# Altium project norbi_lm.PrjPcb (part 1 of 2)
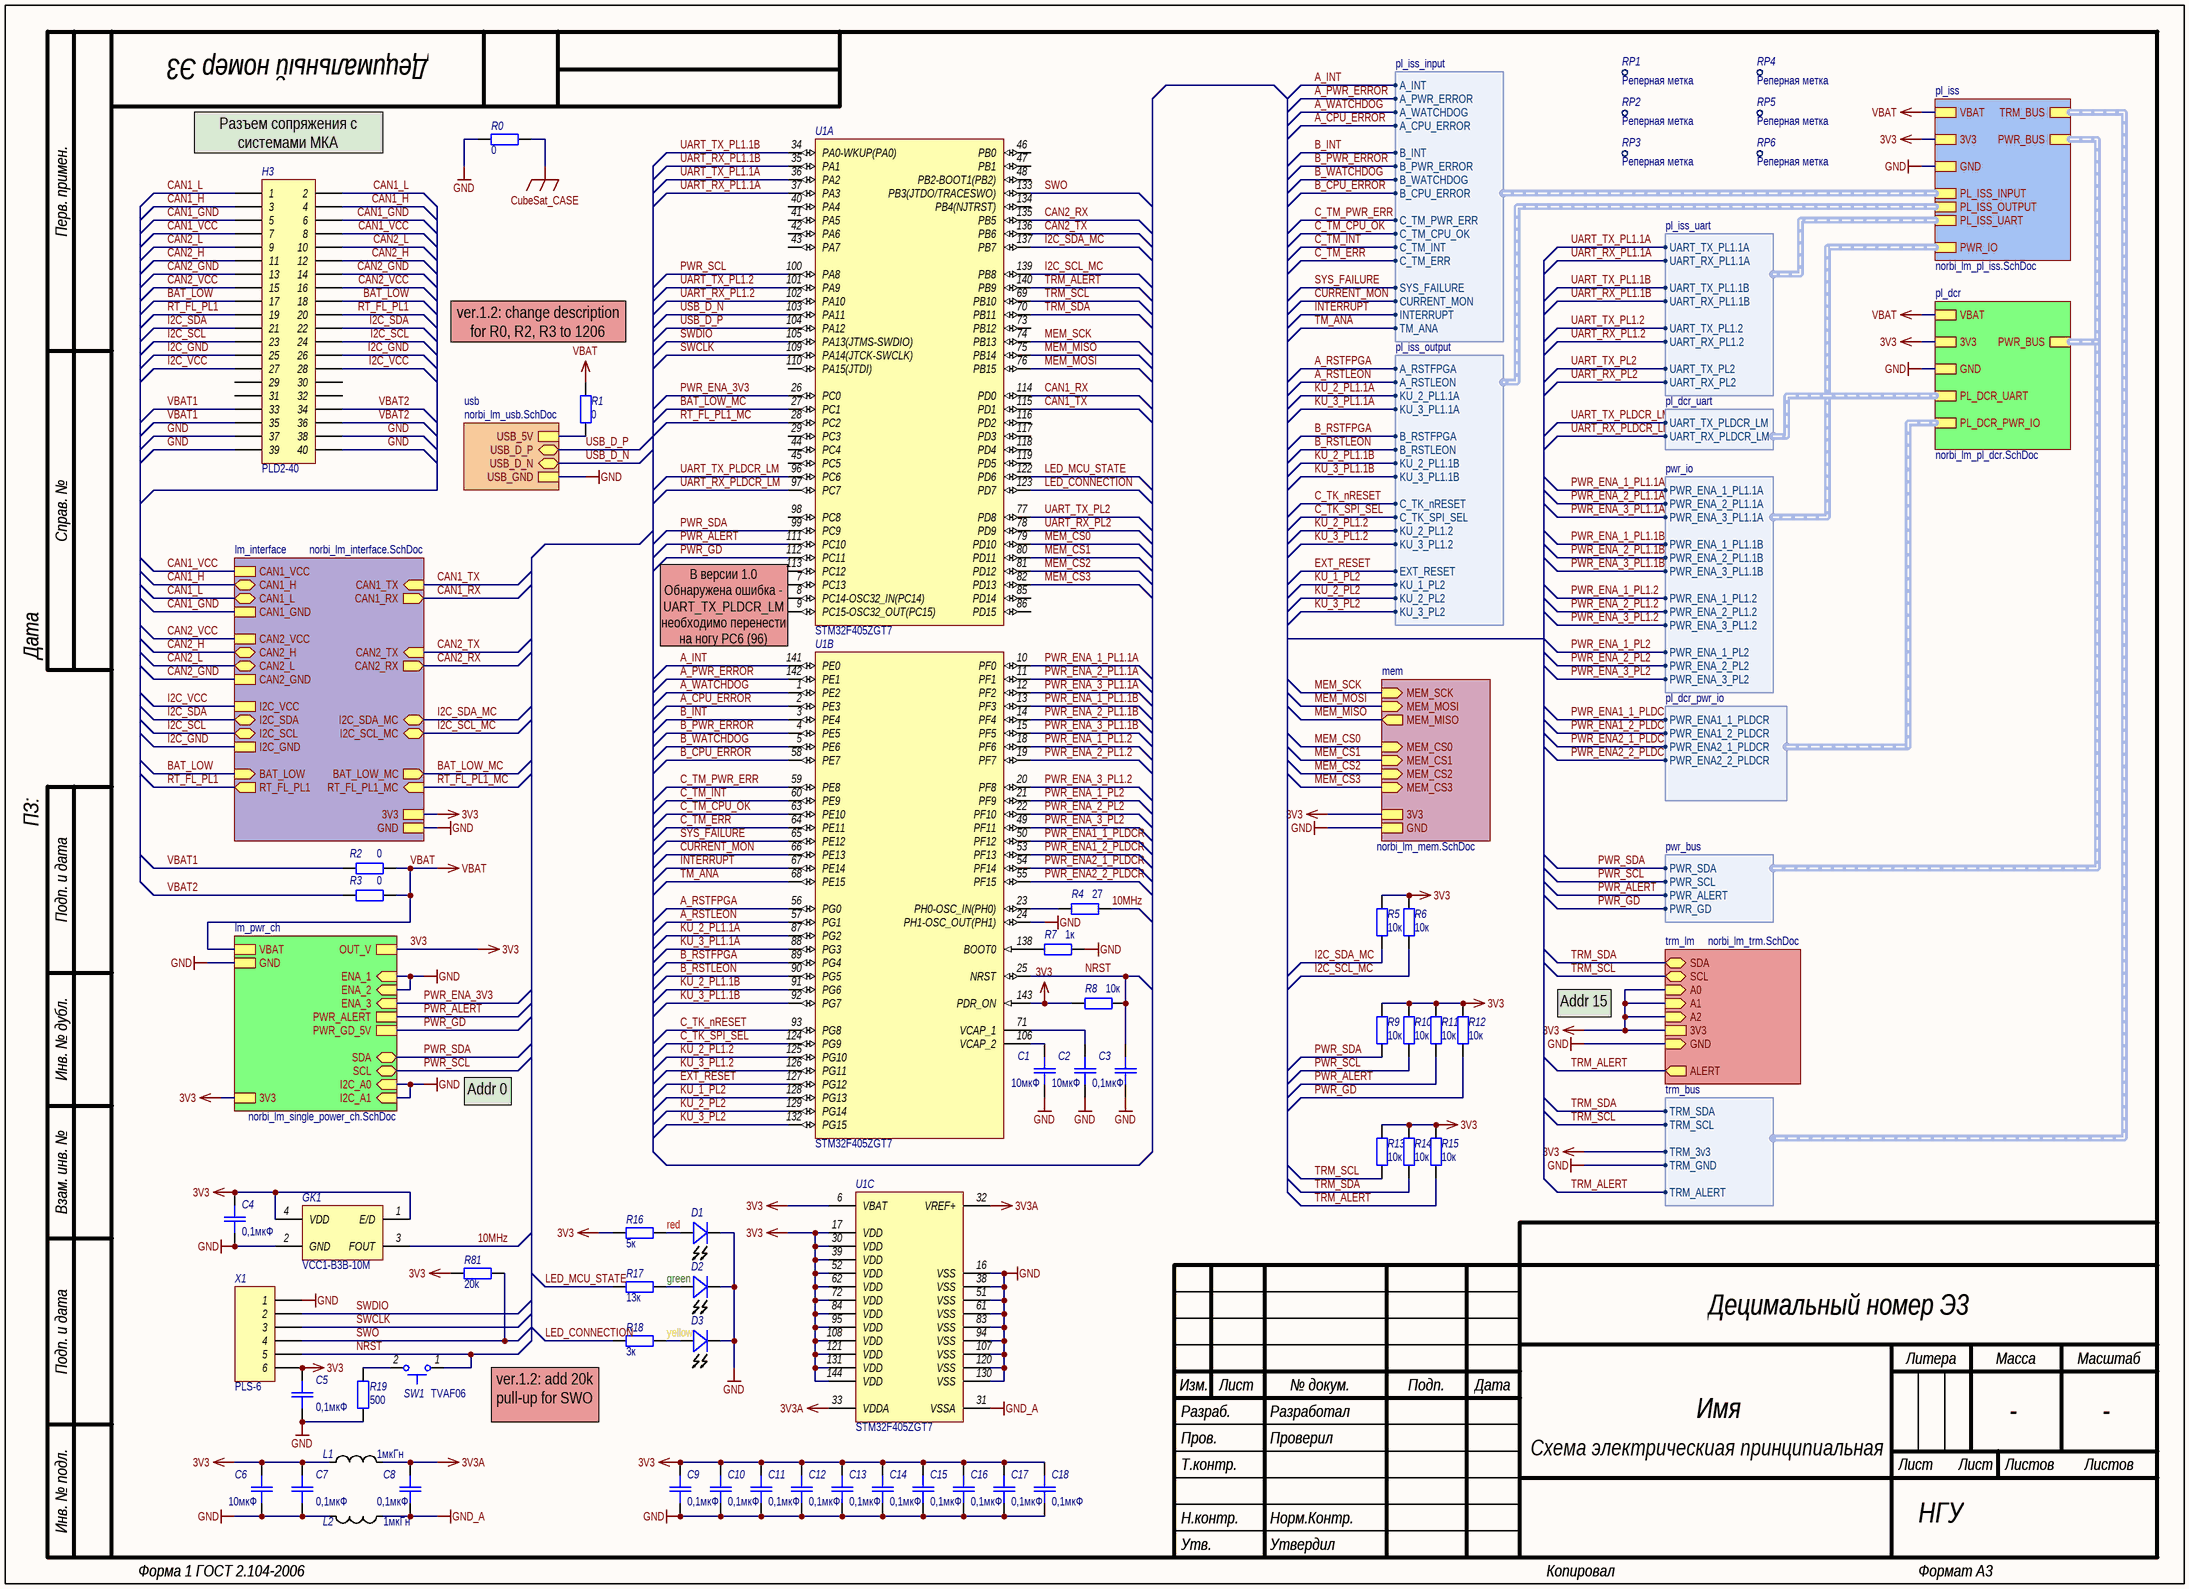
[diagram p0: norbi_lm_main.SchDoc]
10 sheets, 452 parts. Net scope: strictly hierarchical (ports join the sheet entries above them; power ports are local).
Board file: norbi_lm.PcbDoc
Sheets:
  norbi_lm_main.SchDoc
    pl_iss = norbi_lm_pl_iss.SchDoc
      pl_interface_1 = norbi_lm_pl_interface.SchDoc
      pl_interface_2 = norbi_lm_pl_interface.SchDoc
      pl_interface_3 = norbi_lm_pl_interface.SchDoc
      pl_interface_4 = norbi_lm_pl_interface.SchDoc
      pl_pwr_ch_1 = norbi_lm_single_power_ch.SchDoc
      pl_pwr_ch_2 = norbi_lm_single_power_ch.SchDoc
      pl_pwr_ch_3 = norbi_lm_single_power_ch.SchDoc
      pl_pwr_ch_4 = norbi_lm_single_power_ch.SchDoc
    pl_dcr = norbi_lm_pl_dcr.SchDoc
      mcu_pwr = norbi_lm_pl_dcr_power_ch.SchDoc
      measure_pwr = norbi_lm_pl_dcr_power_ch.SchDoc
    lm_interface = norbi_lm_interface.SchDoc
    trm_lm = norbi_lm_trm.SchDoc
    mem = norbi_lm_mem.SchDoc
    lm_pwr_ch = norbi_lm_single_power_ch.SchDoc
    usb = norbi_lm_usb.SchDoc

## Sheet norbi_lm_main.SchDoc: Имя
size 410 x 297 mm; ApprovedBy: Утвердил; CheckedBy: Проверил; Author: Разработал; Organization: НГУ; DocumentNumber: Децимальный номер Э3; SheetNumber: Лист; SheetTotal: Листов; PageSetup: Record=PageOptions|CenterHorizontal=True|CenterVertical=True|PrintScale=1.00|XCorrection=1.00|YCorrection=1.00|PrintKind=1|BorderSize=5000000|LeftOffset=0|BottomOffset=0|Orientation=2|PaperLength=1000|PaperWidth=1000|Scale=100|PaperSource=15|PrintQuality=1200|MediaType=1|DitherType=10|PaperKind=A3|PrintScaleMode=1; Weight: -; ScaleFactor: -; NormInspection: Норм.Контр.

### Parts
C1  10мкФ  [CR-0603]
C2  10мкФ  [CR-0603]
C3  0,1мкФ  [CR-0603]
C4  0,1мкФ  [CR-0603]
C5  0,1мкФ  [CR-0603]
C6  10мкФ  [CR-0603]
C7  0,1мкФ  [CR-0603]
C8  0,1мкФ  [CR-0603]
C9  0,1мкФ  [CR-0603]
C10  0,1мкФ  [CR-0603]
C11  0,1мкФ  [CR-0603]
C12  0,1мкФ  [CR-0603]
C13  0,1мкФ  [CR-0603]
C14  0,1мкФ  [CR-0603]
C15  0,1мкФ  [CR-0603]
C16  0,1мкФ  [CR-0603]
C17  0,1мкФ  [CR-0603]
C18  0,1мкФ  [CR-0603]
D1  value red  [LED-0805]  (hidden comment: LED)
D2  value green  [LED-0805]  (hidden comment: LED)
D3  value yellow  [LED-0805]  (hidden comment: LED)
GK1  Наименование: VCC1-B3B-10M  [5x7 Crystall Oscillatior]  (hidden comment: VCC1)
H3  Наименование: PLD2-40  [PLD2-40 (DS-1025-05 2x20)]  (hidden comment: Header 20X2H)
L1  1мкГн  [CR-0805]
L2  1мкГн  [CR-0805]
R0  0  [CR-0805]
R1  0  [CR-1206]
R2  0  [CR-1206]
R3  0  [CR-1206]
R4  27  [CR-0603]
R5  10к  [CR-0603]
R6  10к  [CR-0603]
R7  1к  [CR-0603]
R8  10к  [CR-0603]
R9  10к  [CR-0603]
R10  10к  [CR-0603]
R11  10к  [CR-0603]
R12  10к  [CR-0603]
R13  10к  [CR-0603]
R14  10к  [CR-0603]
R15  10к  [CR-0603]
R16  5к  [CR-0603]
R17  13к  [CR-0603]
R18  3к  [CR-0603]
R19  500  [CR-0603]
R81  20k  [CR-0603]
RP1  Наименование: Реперная метка  [ReperPoint]  (hidden comment: RP)
RP2  Наименование: Реперная метка  [ReperPoint]  (hidden comment: RP)
RP3  Наименование: Реперная метка  [ReperPoint]  (hidden comment: RP)
RP4  Наименование: Реперная метка  [ReperPoint]  (hidden comment: RP)
RP5  Наименование: Реперная метка  [ReperPoint]  (hidden comment: RP)
RP6  Наименование: Реперная метка  [ReperPoint]  (hidden comment: RP)
SW1  Push button  [TVAF06]  (value not drawn)
U1  STM32F405ZGT7  [LQFP144]  (parts A,B,C of 3)
X1  Наименование: PLS-6  [HDR1X6]  (hidden comment: Header 6)

### Sub-sheets
lm_interface = norbi_lm_interface.SchDoc: RT_FL_PL1 (out), I2C_SCL_MC (bidir), CAN1_L (bidir), CAN2_H (bidir), CAN2_VCC, RT_FL_PL1_MC (in), I2C_VCC, I2C_SDA (bidir), CAN2_GND, I2C_GND, CAN1_VCC, I2C_SCL (bidir), CAN1_H (bidir), GND, BAT_LOW (in), BAT_LOW_MC (out), CAN1_GND, CAN2_L (bidir), 3V3, I2C_SDA_MC (bidir), CAN2_TX (in), CAN2_RX (out), CAN1_TX (in), CAN1_RX (out)
lm_pwr_ch = norbi_lm_single_power_ch.SchDoc: SDA (bidir), SCL (bidir), ENA_1 (in), ENA_2 (in), ENA_3 (in), I2C_A0 (in), I2C_A1 (in), VBAT, 3V3, GND, PWR_ALERT, PWR_GD_5V, OUT_V  | R17_value: 1М; R22_value: NU; R21_value: NU; R20_value: 100; R18_value: 300к; R27_value: 10к; R1_5V_value: 150к; R2_5V_value: 47к; PULL_UP_I2C: NU
mem = norbi_lm_mem.SchDoc: 3V3, MEM_CS3 (in), GND, MEM_CS2 (in), MEM_CS1 (in), MEM_CS0 (in), MEM_SCK (in), MEM_MISO (out), MEM_MOSI (in)
pl_dcr = norbi_lm_pl_dcr.SchDoc: PL_DCR_UART (harness pl_dcr_uart), 3V3, VBAT, PL_DCR_PWR_IO (harness pl_dcr_pwr_io), PWR_BUS (harness pwr_bus), GND
pl_iss = norbi_lm_pl_iss.SchDoc: VBAT, PL_ISS_INPUT (harness pl_iss_input), GND, PL_ISS_OUTPUT (harness pl_iss_output), 3V3, PL_ISS_UART (harness pl_iss_uart), PWR_IO (harness pwr_io), TRM_BUS (harness trm_bus), PWR_BUS (harness pwr_bus)
trm_lm = norbi_lm_trm.SchDoc: A2 (in), A1 (in), A0 (in), ALERT (out), GND (in), 3V3, SCL (bidir), SDA (bidir)
usb = norbi_lm_usb.SchDoc: USB_D_N (bidir), USB_GND, USB_5V, USB_D_P (bidir)

### Harnesses
trm_bus: TRM_3v3, TRM_SDA, TRM_SCL, TRM_ALERT, TRM_GND
pwr_bus: PWR_SDA, PWR_SCL, PWR_ALERT, PWR_GD
pl_iss_uart: UART_TX_PL1.1A, UART_RX_PL1.1A, UART_TX_PL1.1B, UART_RX_PL1.1B, UART_TX_PL1.2, UART_RX_PL1.2, UART_TX_PL2, UART_RX_PL2
pwr_io: PWR_ENA_1_PL1.1A, PWR_ENA_2_PL1.1A, PWR_ENA_3_PL1.1A, PWR_ENA_1_PL1.1B, PWR_ENA_2_PL1.1B, PWR_ENA_3_PL1.1B, PWR_ENA_1_PL1.2, PWR_ENA_2_PL1.2, PWR_ENA_3_PL1.2, PWR_ENA_1_PL2, PWR_ENA_2_PL2, PWR_ENA_3_PL2
pl_iss_input: A_INT, A_PWR_ERROR, A_WATCHDOG, A_CPU_ERROR, B_INT, B_PWR_ERROR, B_WATCHDOG, B_CPU_ERROR, C_TM_PWR_ERR, C_TM_CPU_OK, C_TM_INT, C_TM_ERR, SYS_FAILURE, CURRENT_MON, INTERRUPT, TM_ANA
pl_dcr_uart: UART_TX_PLDCR_LM, UART_RX_PLDCR_LM
pl_iss_output: A_RSTFPGA, A_RSTLEON, KU_2_PL1.1A, KU_3_PL1.1A, B_RSTFPGA, B_RSTLEON, KU_2_PL1.1B, KU_3_PL1.1B, C_TK_nRESET, C_TK_SPI_SEL, KU_2_PL1.2, KU_3_PL1.2, EXT_RESET, KU_1_PL2, KU_2_PL2, KU_3_PL2
pl_dcr_pwr_io: PWR_ENA1_1_PLDCR, PWR_ENA1_2_PLDCR, PWR_ENA2_1_PLDCR, PWR_ENA2_2_PLDCR

### Nets
3V3: C4.2 C5.2 C6.2 C7.2 C9.2 C10.2 C11.2 C12.2 C13.2 C14.2 C15.2 C16.2 C17.2 C18.2 GK1.1(E/D) GK1.4(VDD) L1.1 R5.1 R6.1 R8.2 R9.1 R10.1 R11.1 R12.1 R13.1 R14.1 R15.1 R16.1 R81.1 U1.6(VBAT) U1.17(VDD) U1.30(VDD) U1.39(VDD) U1.52(VDD) U1.62(VDD) U1.72(VDD) U1.84(VDD) U1.95(VDD) U1.108(VDD) U1.121(VDD) U1.131(VDD) U1.143(PDR_ON) U1.144(VDD) X1.6 ; sheet pl_iss/3V3, sheet pl_dcr/3V3, sheet lm_interface/3V3, sheet trm_lm/A2, sheet trm_lm/A1, sheet trm_lm/A0, sheet trm_lm/3V3, sheet mem/3V3, sheet lm_pwr_ch/3V3, sheet lm_pwr_ch/OUT_V, sheet pl_iss/TRM_BUS.TRM_3v3
3V3A: C8.2 L1.2 U1.32(VREF+) U1.33(VDDA)
CAN1_GND: H3.5 H3.6 ; sheet lm_interface/CAN1_GND
CAN1_VCC: H3.7 H3.8 ; sheet lm_interface/CAN1_VCC
CAN2_GND: H3.13 H3.14 ; sheet lm_interface/CAN2_GND
CAN2_VCC: H3.15 H3.16 ; sheet lm_interface/CAN2_VCC
CubeSat_CASE: R0.1
GND: C1.1 C2.1 C3.1 C4.1 C5.1 C6.1 C7.1 C9.1 C10.1 C11.1 C12.1 C13.1 C14.1 C15.1 C16.1 C17.1 C18.1 D1.2(K) D2.2(K) D3.2(K) GK1.2(GND) H3.37 H3.38 H3.39 H3.40 L2.2 R0.2 R7.1 R19.2 U1.16(VSS) U1.24(PH1-OSC_OUT(PH1)) U1.38(VSS) U1.51(VSS) U1.61(VSS) U1.83(VSS) U1.94(VSS) U1.107(VSS) U1.120(VSS) U1.130(VSS) X1.1 ; sheet pl_iss/GND, sheet pl_dcr/GND, sheet lm_interface/GND, sheet trm_lm/GND, sheet mem/GND, sheet lm_pwr_ch/ENA_1, sheet lm_pwr_ch/ENA_2, sheet lm_pwr_ch/I2C_A0, sheet lm_pwr_ch/I2C_A1, sheet lm_pwr_ch/GND, sheet usb/USB_GND, sheet pl_iss/TRM_BUS.TRM_GND
GND_A: C8.1 L2.1 U1.31(VSSA)
I2C_GND: H3.25 H3.26 ; sheet lm_interface/I2C_GND
I2C_VCC: H3.27 H3.28 ; sheet lm_interface/I2C_VCC
VBAT: R1.2 R2.2 R3.2 ; sheet pl_iss/VBAT, sheet pl_dcr/VBAT, sheet lm_pwr_ch/VBAT
10MHz: GK1.3(FOUT) R4.2
A_CPU_ERROR: U1.2(PE3) ; sheet pl_iss/PL_ISS_INPUT.A_CPU_ERROR
A_INT: U1.141(PE0) ; sheet pl_iss/PL_ISS_INPUT.A_INT
A_PWR_ERROR: U1.142(PE1) ; sheet pl_iss/PL_ISS_INPUT.A_PWR_ERROR
A_RSTFPGA: U1.56(PG0) ; sheet pl_iss/PL_ISS_OUTPUT.A_RSTFPGA
A_RSTLEON: U1.57(PG1) ; sheet pl_iss/PL_ISS_OUTPUT.A_RSTLEON
A_WATCHDOG: U1.1(PE2) ; sheet pl_iss/PL_ISS_INPUT.A_WATCHDOG
B_CPU_ERROR: U1.58(PE7) ; sheet pl_iss/PL_ISS_INPUT.B_CPU_ERROR
B_INT: U1.3(PE4) ; sheet pl_iss/PL_ISS_INPUT.B_INT
B_PWR_ERROR: U1.4(PE5) ; sheet pl_iss/PL_ISS_INPUT.B_PWR_ERROR
B_RSTFPGA: U1.89(PG4) ; sheet pl_iss/PL_ISS_OUTPUT.B_RSTFPGA
B_RSTLEON: U1.90(PG5) ; sheet pl_iss/PL_ISS_OUTPUT.B_RSTLEON
B_WATCHDOG: U1.5(PE6) ; sheet pl_iss/PL_ISS_INPUT.B_WATCHDOG
BAT_LOW: H3.17 H3.18 ; sheet lm_interface/BAT_LOW
BAT_LOW_MC: U1.27(PC1) ; sheet lm_interface/BAT_LOW_MC
C_TK_nRESET: U1.93(PG8) ; sheet pl_iss/PL_ISS_OUTPUT.C_TK_nRESET
C_TK_SPI_SEL: U1.124(PG9) ; sheet pl_iss/PL_ISS_OUTPUT.C_TK_SPI_SEL
C_TM_CPU_OK: U1.63(PE10) ; sheet pl_iss/PL_ISS_INPUT.C_TM_CPU_OK
C_TM_ERR: U1.64(PE11) ; sheet pl_iss/PL_ISS_INPUT.C_TM_ERR
C_TM_INT: U1.60(PE9) ; sheet pl_iss/PL_ISS_INPUT.C_TM_INT
C_TM_PWR_ERR: U1.59(PE8) ; sheet pl_iss/PL_ISS_INPUT.C_TM_PWR_ERR
CAN1_H: H3.3 H3.4 ; sheet lm_interface/CAN1_H
CAN1_L: H3.1 H3.2 ; sheet lm_interface/CAN1_L
CAN1_RX: U1.114(PD0) ; sheet lm_interface/CAN1_RX
CAN1_TX: U1.115(PD1) ; sheet lm_interface/CAN1_TX
CAN2_H: H3.11 H3.12 ; sheet lm_interface/CAN2_H
CAN2_L: H3.9 H3.10 ; sheet lm_interface/CAN2_L
CAN2_RX: U1.135(PB5) ; sheet lm_interface/CAN2_RX
CAN2_TX: U1.136(PB6) ; sheet lm_interface/CAN2_TX
CURRENT_MON: U1.66(PE13) ; sheet pl_iss/PL_ISS_INPUT.CURRENT_MON
EXT_RESET: U1.127(PG12) ; sheet pl_iss/PL_ISS_OUTPUT.EXT_RESET
I2C_SCL: H3.23 H3.24 ; sheet lm_interface/I2C_SCL
I2C_SCL_MC: R6.2 U1.139(PB8) ; sheet lm_interface/I2C_SCL_MC
I2C_SDA: H3.21 H3.22 ; sheet lm_interface/I2C_SDA
I2C_SDA_MC: R5.2 U1.137(PB7) ; sheet lm_interface/I2C_SDA_MC
INTERRUPT: U1.67(PE14) ; sheet pl_iss/PL_ISS_INPUT.INTERRUPT
KU_1_PL2: U1.128(PG13) ; sheet pl_iss/PL_ISS_OUTPUT.KU_1_PL2
KU_2_PL1.1A: U1.87(PG2) ; sheet pl_iss/PL_ISS_OUTPUT.KU_2_PL1.1A
KU_2_PL1.1B: U1.91(PG6) ; sheet pl_iss/PL_ISS_OUTPUT.KU_2_PL1.1B
KU_2_PL1.2: U1.125(PG10) ; sheet pl_iss/PL_ISS_OUTPUT.KU_2_PL1.2
KU_2_PL2: U1.129(PG14) ; sheet pl_iss/PL_ISS_OUTPUT.KU_2_PL2
KU_3_PL1.1A: U1.88(PG3) ; sheet pl_iss/PL_ISS_OUTPUT.KU_3_PL1.1A
KU_3_PL1.1B: U1.92(PG7) ; sheet pl_iss/PL_ISS_OUTPUT.KU_3_PL1.1B
KU_3_PL1.2: U1.126(PG11) ; sheet pl_iss/PL_ISS_OUTPUT.KU_3_PL1.2
KU_3_PL2: U1.132(PG15) ; sheet pl_iss/PL_ISS_OUTPUT.KU_3_PL2
LED_CONNECTION: R18.1 U1.123(PD7)
LED_MCU_STATE: R17.1 U1.122(PD6)
MEM_CS0: U1.79(PD10) ; sheet mem/MEM_CS0
MEM_CS1: U1.80(PD11) ; sheet mem/MEM_CS1
MEM_CS2: U1.81(PD12) ; sheet mem/MEM_CS2
MEM_CS3: U1.82(PD13) ; sheet mem/MEM_CS3
MEM_MISO: U1.75(PB14) ; sheet mem/MEM_MISO
MEM_MOSI: U1.76(PB15) ; sheet mem/MEM_MOSI
MEM_SCK: U1.74(PB13) ; sheet mem/MEM_SCK
NRST: C3.2 R8.1 SW1.1 U1.25(NRST) X1.5
PWR_ALERT: R11.2 U1.111(PC10) ; sheet lm_pwr_ch/PWR_ALERT, sheet pl_iss/PWR_BUS.PWR_ALERT
PWR_ENA1_1_PLDCR: U1.50(PF12) ; sheet pl_dcr/PL_DCR_PWR_IO.PWR_ENA1_1_PLDCR
PWR_ENA1_2_PLDCR: U1.53(PF13) ; sheet pl_dcr/PL_DCR_PWR_IO.PWR_ENA1_2_PLDCR
PWR_ENA2_1_PLDCR: U1.54(PF14) ; sheet pl_dcr/PL_DCR_PWR_IO.PWR_ENA2_1_PLDCR
PWR_ENA2_2_PLDCR: U1.55(PF15) ; sheet pl_dcr/PL_DCR_PWR_IO.PWR_ENA2_2_PLDCR
PWR_ENA_1_PL1.1A: U1.10(PF0) ; sheet pl_iss/PWR_IO.PWR_ENA_1_PL1.1A
PWR_ENA_1_PL1.1B: U1.13(PF3) ; sheet pl_iss/PWR_IO.PWR_ENA_1_PL1.1B
PWR_ENA_1_PL1.2: U1.18(PF6) ; sheet pl_iss/PWR_IO.PWR_ENA_1_PL1.2
PWR_ENA_1_PL2: U1.21(PF9) ; sheet pl_iss/PWR_IO.PWR_ENA_1_PL2
PWR_ENA_2_PL1.1A: U1.11(PF1) ; sheet pl_iss/PWR_IO.PWR_ENA_2_PL1.1A
PWR_ENA_2_PL1.1B: U1.14(PF4) ; sheet pl_iss/PWR_IO.PWR_ENA_2_PL1.1B
PWR_ENA_2_PL1.2: U1.19(PF7) ; sheet pl_iss/PWR_IO.PWR_ENA_2_PL1.2
PWR_ENA_2_PL2: U1.22(PF10) ; sheet pl_iss/PWR_IO.PWR_ENA_2_PL2
PWR_ENA_3_PL1.1A: U1.12(PF2) ; sheet pl_iss/PWR_IO.PWR_ENA_3_PL1.1A
PWR_ENA_3_PL1.1B: U1.15(PF5) ; sheet pl_iss/PWR_IO.PWR_ENA_3_PL1.1B
PWR_ENA_3_PL1.2: U1.20(PF8) ; sheet pl_iss/PWR_IO.PWR_ENA_3_PL1.2
PWR_ENA_3_PL2: U1.49(PF11) ; sheet pl_iss/PWR_IO.PWR_ENA_3_PL2
PWR_ENA_3V3: U1.26(PC0) ; sheet lm_pwr_ch/ENA_3
PWR_GD: R12.2 U1.112(PC11) ; sheet lm_pwr_ch/PWR_GD_5V, sheet pl_iss/PWR_BUS.PWR_GD
PWR_SCL: R10.2 U1.100(PA8) ; sheet lm_pwr_ch/SCL, sheet pl_iss/PWR_BUS.PWR_SCL
PWR_SDA: R9.2 U1.99(PC9) ; sheet lm_pwr_ch/SDA, sheet pl_iss/PWR_BUS.PWR_SDA
RT_FL_PL1: H3.19 H3.20 ; sheet lm_interface/RT_FL_PL1
RT_FL_PL1_MC: U1.28(PC2) ; sheet lm_interface/RT_FL_PL1_MC
SWCLK: U1.109(PA14(JTCK-SWCLK)) X1.3
SWDIO: U1.105(PA13(JTMS-SWDIO)) X1.2
SWO: R81.2 U1.133(PB3(JTDO/TRACESWO)) X1.4
SYS_FAILURE: U1.65(PE12) ; sheet pl_iss/PL_ISS_INPUT.SYS_FAILURE
TM_ANA: U1.68(PE15) ; sheet pl_iss/PL_ISS_INPUT.TM_ANA
TRM_ALERT: R15.2 U1.140(PB9) ; sheet trm_lm/ALERT, sheet pl_iss/TRM_BUS.TRM_ALERT
TRM_SCL: R13.2 U1.69(PB10) ; sheet trm_lm/SCL, sheet pl_iss/TRM_BUS.TRM_SCL
TRM_SDA: R14.2 U1.70(PB11) ; sheet trm_lm/SDA, sheet pl_iss/TRM_BUS.TRM_SDA
UART_RX_PL1.1A: U1.37(PA3) ; sheet pl_iss/PL_ISS_UART.UART_RX_PL1.1A
UART_RX_PL1.1B: U1.35(PA1) ; sheet pl_iss/PL_ISS_UART.UART_RX_PL1.1B
UART_RX_PL1.2: U1.102(PA10) ; sheet pl_iss/PL_ISS_UART.UART_RX_PL1.2
UART_RX_PL2: U1.78(PD9) ; sheet pl_iss/PL_ISS_UART.UART_RX_PL2
UART_RX_PLDCR_LM: U1.97(PC7) ; sheet pl_dcr/PL_DCR_UART.UART_RX_PLDCR_LM
UART_TX_PL1.1A: U1.36(PA2) ; sheet pl_iss/PL_ISS_UART.UART_TX_PL1.1A
UART_TX_PL1.1B: U1.34(PA0-WKUP(PA0)) ; sheet pl_iss/PL_ISS_UART.UART_TX_PL1.1B
UART_TX_PL1.2: U1.101(PA9) ; sheet pl_iss/PL_ISS_UART.UART_TX_PL1.2
UART_TX_PL2: U1.77(PD8) ; sheet pl_iss/PL_ISS_UART.UART_TX_PL2
UART_TX_PLDCR_LM: U1.96(PC6) ; sheet pl_dcr/PL_DCR_UART.UART_TX_PLDCR_LM
USB_D_N: U1.103(PA11) ; sheet usb/USB_D_N
USB_D_P: U1.104(PA12) ; sheet usb/USB_D_P
VBAT1: H3.33 H3.35 R2.1
VBAT2: H3.34 H3.36 R3.1
NetC1_2: C1.2 U1.106(VCAP_2)
NetC2_2: C2.2 U1.71(VCAP_1)
NetD1_1: D1.1(A) R16.2
NetD2_1: D2.1(A) R17.2
NetD3_1: D3.1(A) R18.2
NetR1_1: R1.1 ; sheet usb/USB_5V
NetR4_1: R4.1 U1.23(PH0-OSC_IN(PH0))
NetR7_2: R7.2 U1.138(BOOT0)
NetR19_1: R19.1 SW1.2

Not connected (* = marked no-connect by the designer): H3 29 30 31 32; U1 7(PC13) 8(PC14-OSC32_IN(PC14)) 9(PC15-OSC32_OUT(PC15)) 29(PC3) 40(PA4) 41(PA5) 42(PA6) 43(PA7) 44(PC4) 45(PC5) 46(PB0) 47(PB1) 48(PB2-BOOT1(PB2)) 73(PB12) 85(PD14) 86(PD15) 98(PC8) 110(PA15(JTDI)) 113(PC12) 116(PD2) 117(PD3) 118(PD4) 119(PD5) 134(PB4(NJTRST))

### Buses and harness runs
harness sheet pl_dcr/PWR_BUS = sheet pl_iss/PWR_BUS

### Notes on the sheet
- (near H3) Разъем сопряжения с системами МКА
- ver.1.2: change description for R0, R2, R3 to 1206
- (near U1) В версии 1.0 Обнаружена ошибка - UART_TX_PLDCR_LM необходимо перенести на ногу PC6 (96)
- Addr 15
- Addr 0
- ver.1.2: add 20k pull-up for SWO
- Перв. примен.
- Справ. №
- ПЗ:                             Дата
- Подп. и дата
- Инв. № дубл.
- Взам. инв. №
- Разраб.
- Изм.
- Лист
- № докум.
- Подп.
- Дата
- Литера
- Масса
- Масштаб
- Пров.
- Т.контр.
- Схема электрическиая принципиальная
- Листов
- Инв. № подл.
- Н.контр.
- Утв.
- Форма 1 ГОСТ 2.104-2006
- Копировал
- Формат А3

### Library data of the parts
C1-C18 = C_smd: Конденсатор для поверхностного монтажа; Назначение: Чип-конденсатор; Потребление, Вт: 0; Наименование: SMD-0603
  C1 C2 C6: Value: 10мкФ
  C3-C5 C7-C18: Value: 0,1мкФ
D1-D3 = LED: Назначение: Светодиод; Наименование: LED SMD-0805; Потребление, Вт: 0,01
GK1 = Crystall Oscillator: Назначение: Кварцевый генератор 7x5мм 20 МГц; Потребление, Вт: 0,01
H3 = HDR2X20: Header, 20-Pin, Dual row, Right Angle; Потребление, Вт: 0,0; Назначение: Header, 20-Pin, Dual row, Right Angle
L1 L2 = L_smd: Индуктивность для поверхностнгого монтажа; Назначение: Чип-индуктивность; Потребление, Вт: 0,010; Value: 1мкГн; Наименование: Индуктивность
R0 R4-R19 R81 = R_smd: Резистор для поверхностного монтажа; Наименование: SMD-0603,  20%; Назначение: Чип-резистор; Потребление, Вт: 0,001
  R0: Value: 0
  R4: Value: 27
  R5 R6 R8-R15: Value: 10к
  R7: Value: 1к
  R16: Value: 5к
  R17: Value: 13к
  R18: Value: 3к
  R19: Value: 500
  R81: Value: 20k
R1-R3 = R_smd: Резистор для поверхностного монтажа; Наименование: SMD-1206,  20%; Назначение: Чип-резистор; Потребление, Вт: 0,001; Value: 0
RP1-RP6 = RP: Назначение: реперная метка для автоматического монтажа
SW1 = Push_Button: Потребление, Вт: 0,001; Назначение: Push button; Наименование: TVAF06
U1 = STM32F405ZGT: ARM Cortex-M4 32-bit MCU+FPU, 210 DMIPS, 1024 kB Flash, 192 kB Internal RAM, 114 I/Os, 144-pin LQFP, -40 to 105 degC, Tray; Наименование: STM32F405ZGT7; Назначение: ARM Cortex-M4 32-bit MCU+FPU; Потребление, Вт: *; ComponentLink1Description: Datasheet; ComponentLink1URL: http://www.st.com/st-web-ui/static/active/en/resource/technical/document/datasheet/DM00037051.pdf
X1 = Header 6: Header, 6-Pin; Назначение: Отладочный разъем; LatestRevisionDate: 17-Jul-2002; LatestRevisionNote: Re-released for DXP Platform.; Publisher: Altium Limited

## Sheet norbi_lm_pl_iss.SchDoc: Имя
size 410 x 297 mm; ApprovedBy: Утвердил; CheckedBy: Проверил; Author: Разработал; Organization: НГУ; DocumentNumber: Децимальный номер Э3; SheetNumber: Лист; SheetTotal: Листов; PageSetup: Record=PageOptions|CenterHorizontal=True|CenterVertical=True|PrintScale=1.00|XCorrection=1.00|YCorrection=1.00|PrintKind=1|BorderSize=5000000|LeftOffset=0|BottomOffset=0|Orientation=2|PaperLength=1000|PaperWidth=1000|Scale=100|PaperSource=15|PrintQuality=1200|MediaType=1|DitherType=10|PaperKind=A3|PrintScaleMode=1; Weight: -; ScaleFactor: -; NormInspection: Норм.Контр.
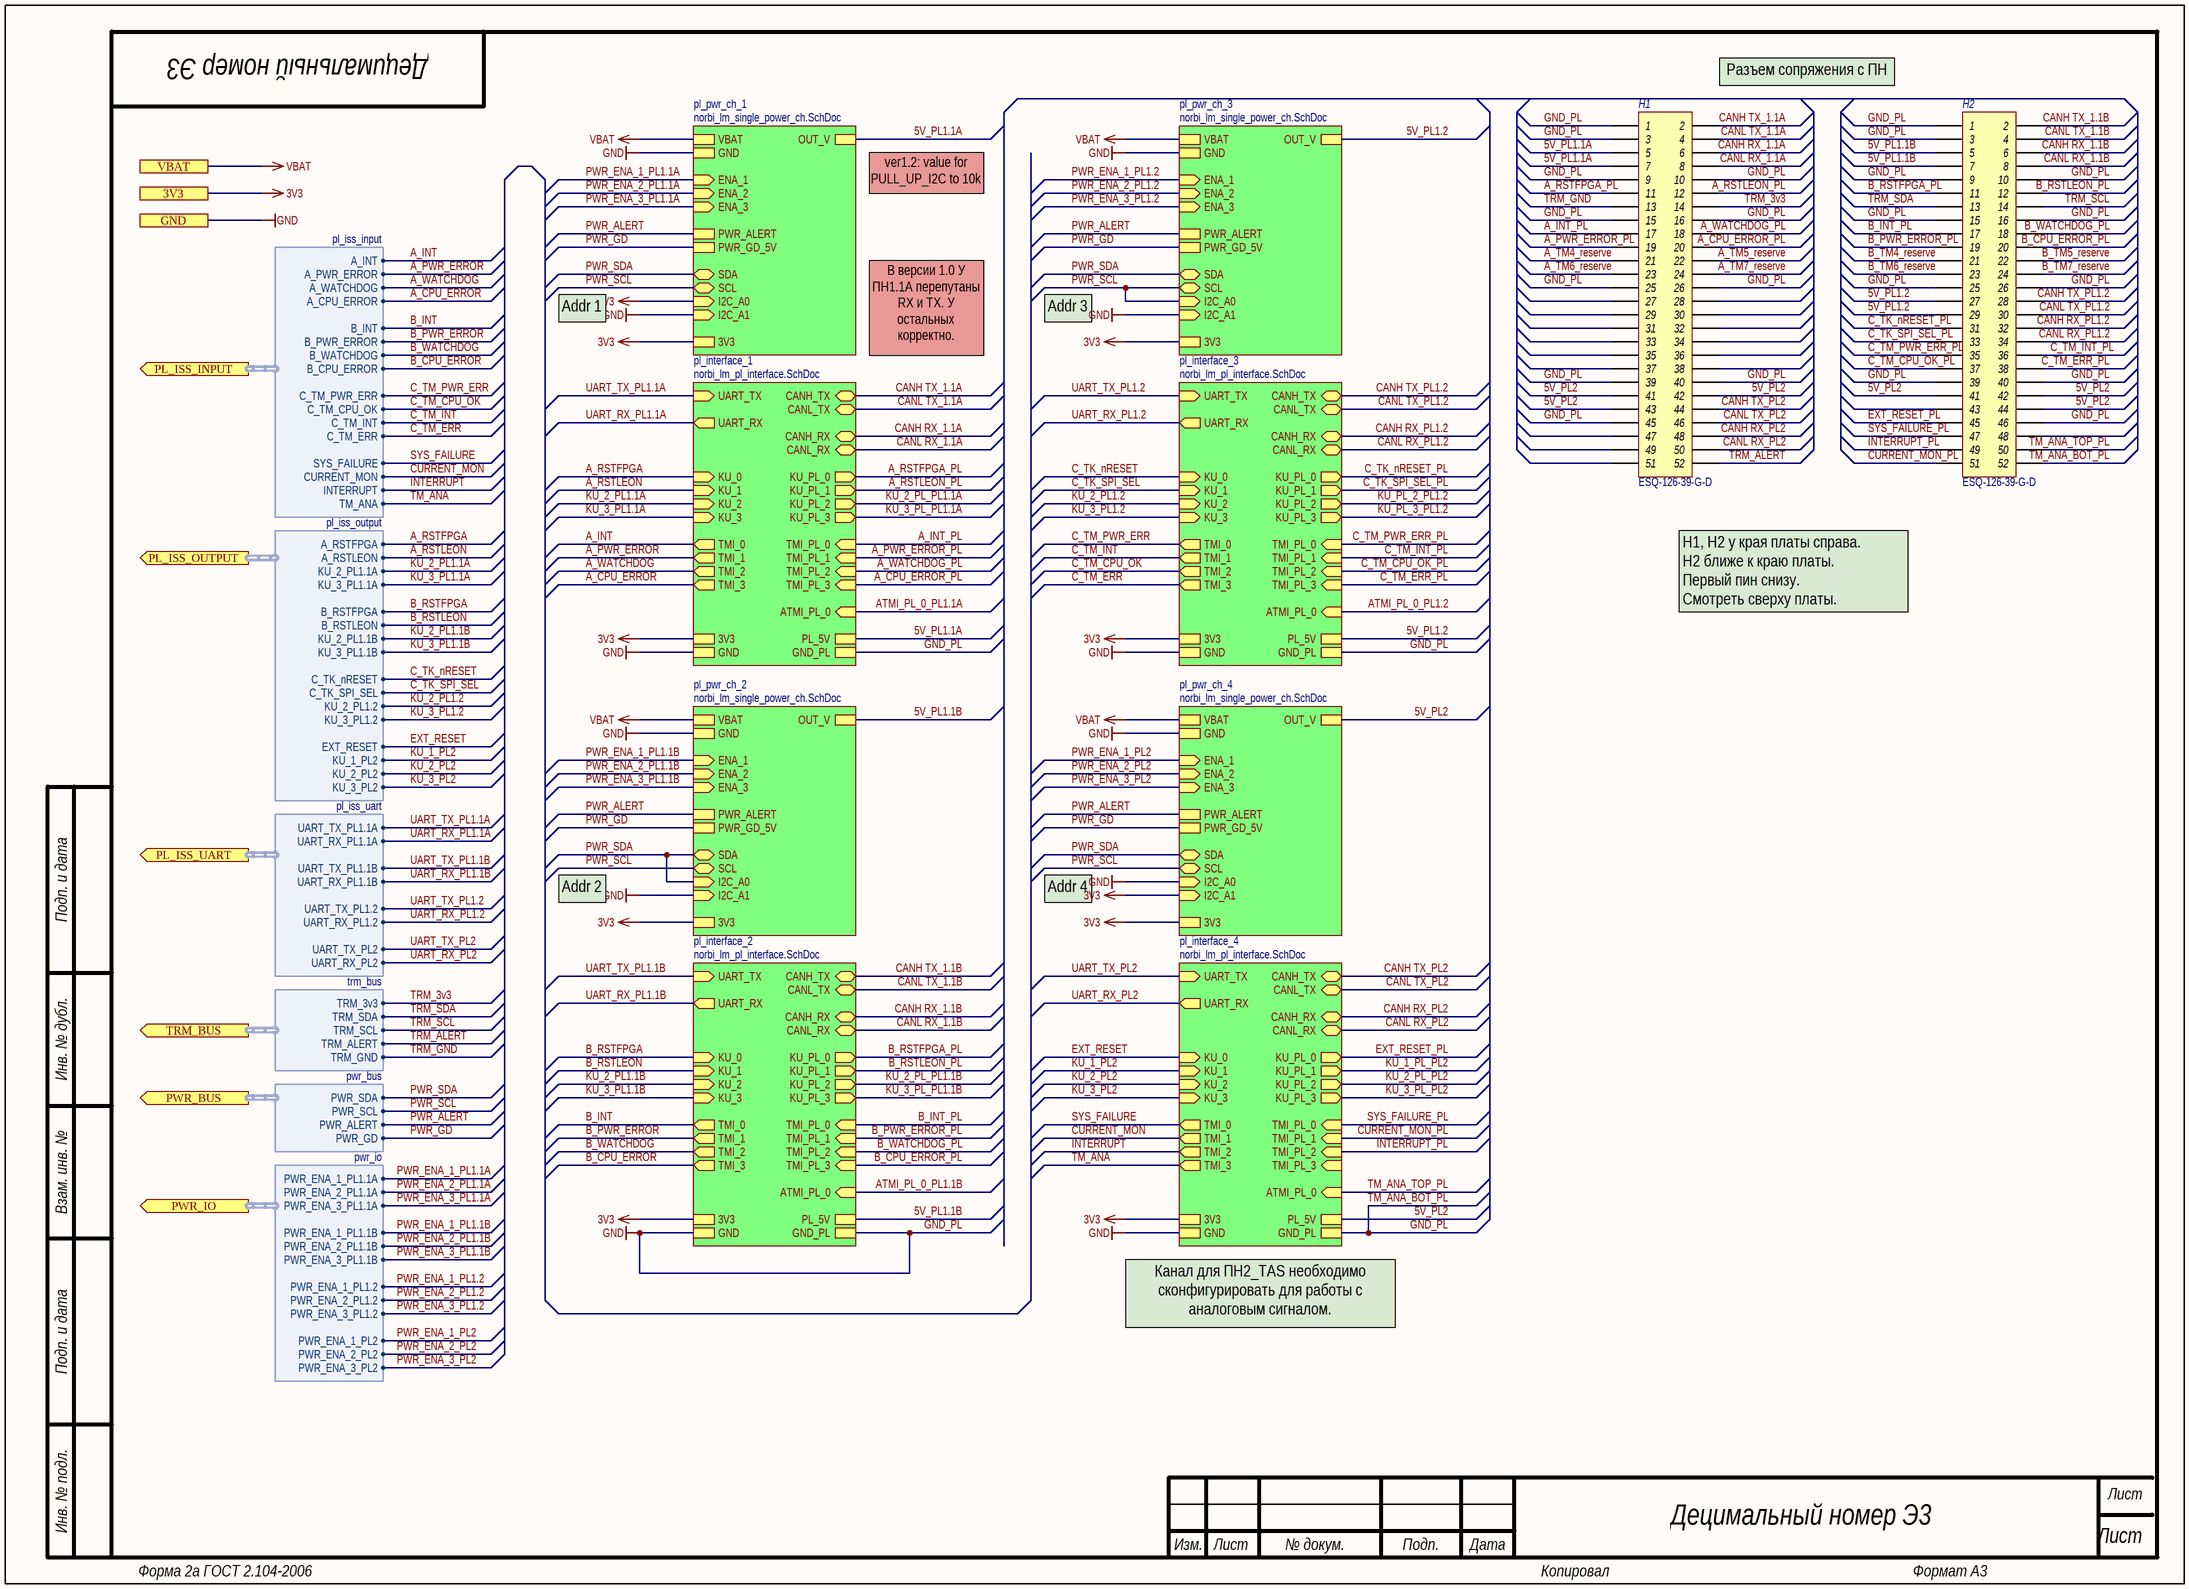
[diagram p1: norbi_lm_pl_iss.SchDoc]

### Parts
H1  ESQ-126-39-G-D  [ESQ-126-39-G-D]
H2  ESQ-126-39-G-D  [ESQ-126-39-G-D]

### Sub-sheets
pl_interface_1 = norbi_lm_pl_interface.SchDoc: KU_2 (in), CANL_TX (bidir), TMI_1 (out), KU_0 (in), TMI_0 (out), TMI_2 (out), TMI_3 (out), CANL_RX (bidir), CANH_TX (bidir), KU_3 (in), CANH_RX (bidir), KU_1 (in), TMI_PL_3 (in), KU_PL_1 (out), TMI_PL_2 (in), TMI_PL_1 (in), KU_PL_0 (out), TMI_PL_0 (in), KU_PL_3 (out), KU_PL_2 (out), ATMI_PL_0 (in), PL_5V, UART_RX (out), GND, GND_PL, UART_TX (in), 3V3
pl_interface_2 = norbi_lm_pl_interface.SchDoc: KU_2 (in), CANL_TX (bidir), TMI_1 (out), KU_0 (in), TMI_0 (out), TMI_2 (out), TMI_3 (out), CANL_RX (bidir), CANH_TX (bidir), KU_3 (in), CANH_RX (bidir), KU_1 (in), TMI_PL_3 (in), KU_PL_1 (out), TMI_PL_2 (in), TMI_PL_1 (in), KU_PL_0 (out), TMI_PL_0 (in), KU_PL_3 (out), KU_PL_2 (out), ATMI_PL_0 (in), PL_5V, UART_RX (out), GND, GND_PL, UART_TX (in), 3V3
pl_interface_3 = norbi_lm_pl_interface.SchDoc: KU_2 (in), CANL_TX (bidir), TMI_1 (out), KU_0 (in), TMI_0 (out), TMI_2 (out), TMI_3 (out), CANL_RX (bidir), CANH_TX (bidir), KU_3 (in), CANH_RX (bidir), KU_1 (in), TMI_PL_3 (in), KU_PL_1 (out), TMI_PL_2 (in), TMI_PL_1 (in), KU_PL_0 (out), TMI_PL_0 (in), KU_PL_3 (out), KU_PL_2 (out), ATMI_PL_0 (in), PL_5V, UART_RX (out), GND, GND_PL, UART_TX (in), 3V3
pl_interface_4 = norbi_lm_pl_interface.SchDoc: KU_2 (in), CANL_TX (bidir), TMI_1 (out), KU_0 (in), TMI_0 (out), TMI_2 (out), TMI_3 (out), CANL_RX (bidir), CANH_TX (bidir), KU_3 (in), CANH_RX (bidir), KU_1 (in), TMI_PL_3 (in), KU_PL_1 (out), TMI_PL_2 (in), TMI_PL_1 (in), KU_PL_0 (out), TMI_PL_0 (in), KU_PL_3 (out), KU_PL_2 (out), ATMI_PL_0 (in), PL_5V, UART_RX (out), GND, GND_PL, UART_TX (in), 3V3
pl_pwr_ch_1 = norbi_lm_single_power_ch.SchDoc: SDA (bidir), SCL (bidir), ENA_1 (in), ENA_2 (in), ENA_3 (in), I2C_A0 (in), I2C_A1 (in), VBAT, 3V3, GND, PWR_ALERT, PWR_GD_5V, OUT_V  | R17_value: 1М; R22_value: 100; R21_value: 100; R20_value: 100; R18_value: 300к; R27_value: NU; R1_5V_value: 160к; R2_5V_value: 30к; PULL_UP_I2C: 10к
pl_pwr_ch_2 = norbi_lm_single_power_ch.SchDoc: SDA (bidir), SCL (bidir), ENA_1 (in), ENA_2 (in), ENA_3 (in), I2C_A0 (in), I2C_A1 (in), VBAT, 3V3, GND, PWR_ALERT, PWR_GD_5V, OUT_V  | R17_value: 1М; R22_value: 100; R21_value: 100; R20_value: 100; R18_value: 300к; R27_value: NU; R1_5V_value: 160к; R2_5V_value: 30к; PULL_UP_I2C: NU
pl_pwr_ch_3 = norbi_lm_single_power_ch.SchDoc: SDA (bidir), SCL (bidir), ENA_1 (in), ENA_2 (in), ENA_3 (in), I2C_A0 (in), I2C_A1 (in), VBAT, 3V3, GND, PWR_ALERT, PWR_GD_5V, OUT_V  | R17_value: 1М; R22_value: 100; R21_value: 100; R20_value: 100; R18_value: 300к; R27_value: NU; R1_5V_value: 160к; R2_5V_value: 30к; PULL_UP_I2C: NU
pl_pwr_ch_4 = norbi_lm_single_power_ch.SchDoc: SDA (bidir), SCL (bidir), ENA_1 (in), ENA_2 (in), ENA_3 (in), I2C_A0 (in), I2C_A1 (in), VBAT, 3V3, GND, PWR_ALERT, PWR_GD_5V, OUT_V  | R17_value: 1М; R22_value: 100; R21_value: 100; R20_value: 100; R18_value: 300к; R27_value: NU; R1_5V_value: 160к; R2_5V_value: 30к; PULL_UP_I2C: NU

### Ports
3V3, GND, PL_ISS_INPUT (out, harness pl_iss_input), PL_ISS_OUTPUT (out, harness pl_iss_output), PL_ISS_UART (out, harness pl_iss_uart), PWR_BUS (out, harness pwr_bus), PWR_IO (out, harness pwr_io), TRM_BUS (out, harness trm_bus), VBAT

### Harnesses
pl_iss_input: A_INT, A_PWR_ERROR, A_WATCHDOG, A_CPU_ERROR, B_INT, B_PWR_ERROR, B_WATCHDOG, B_CPU_ERROR, C_TM_PWR_ERR, C_TM_CPU_OK, C_TM_INT, C_TM_ERR, SYS_FAILURE, CURRENT_MON, INTERRUPT, TM_ANA
pl_iss_output: A_RSTFPGA, A_RSTLEON, KU_2_PL1.1A, KU_3_PL1.1A, B_RSTFPGA, B_RSTLEON, KU_2_PL1.1B, KU_3_PL1.1B, C_TK_nRESET, C_TK_SPI_SEL, KU_2_PL1.2, KU_3_PL1.2, EXT_RESET, KU_1_PL2, KU_2_PL2, KU_3_PL2
pl_iss_uart: UART_TX_PL1.1A, UART_RX_PL1.1A, UART_TX_PL1.1B, UART_RX_PL1.1B, UART_TX_PL1.2, UART_RX_PL1.2, UART_TX_PL2, UART_RX_PL2
trm_bus: TRM_3v3, TRM_SDA, TRM_SCL, TRM_ALERT, TRM_GND
pwr_bus: PWR_SDA, PWR_SCL, PWR_ALERT, PWR_GD
pwr_io: PWR_ENA_1_PL1.1A, PWR_ENA_2_PL1.1A, PWR_ENA_3_PL1.1A, PWR_ENA_1_PL1.1B, PWR_ENA_2_PL1.1B, PWR_ENA_3_PL1.1B, PWR_ENA_1_PL1.2, PWR_ENA_2_PL1.2, PWR_ENA_3_PL1.2, PWR_ENA_1_PL2, PWR_ENA_2_PL2, PWR_ENA_3_PL2

### Nets
3V3: H1.14 ; port 3V3, sheet pl_interface_1/3V3, sheet pl_interface_2/3V3, sheet pl_interface_3/3V3, sheet pl_interface_4/3V3, sheet pl_pwr_ch_1/I2C_A0, sheet pl_pwr_ch_1/3V3, sheet pl_pwr_ch_2/3V3, sheet pl_pwr_ch_3/3V3, sheet pl_pwr_ch_4/I2C_A1, sheet pl_pwr_ch_4/3V3, port TRM_BUS.TRM_3v3  [also labelled TRM_3v3]
5V_PL1.1B: H2.5 H2.7 ; sheet pl_interface_2/PL_5V, sheet pl_pwr_ch_2/OUT_V
5V_PL1.1А: H1.5 H1.7 ; sheet pl_interface_1/PL_5V, sheet pl_pwr_ch_1/OUT_V
5V_PL1.2: H2.27 H2.29 ; sheet pl_interface_3/PL_5V, sheet pl_pwr_ch_3/OUT_V
5V_PL2: H1.41 H1.42 H1.43 H2.41 H2.42 H2.44 ; sheet pl_interface_4/PL_5V, sheet pl_pwr_ch_4/OUT_V
GND: H1.1 H1.3 H1.9 H1.10 H1.13 H1.15 H1.16 H1.25 H1.26 H1.39 H1.40 H1.45 H2.1 H2.3 H2.9 H2.10 H2.15 H2.16 H2.25 H2.26 H2.39 H2.40 H2.46 H2.52 ; port GND, sheet pl_interface_1/GND, sheet pl_interface_1/GND_PL, sheet pl_interface_2/GND, sheet pl_interface_2/GND_PL, sheet pl_interface_3/GND, sheet pl_interface_3/GND_PL, sheet pl_interface_4/GND, sheet pl_interface_4/GND_PL, sheet pl_pwr_ch_1/I2C_A1, sheet pl_pwr_ch_1/GND, sheet pl_pwr_ch_2/I2C_A1, sheet pl_pwr_ch_2/GND, sheet pl_pwr_ch_3/I2C_A1, sheet pl_pwr_ch_3/GND, sheet pl_pwr_ch_4/I2C_A0, sheet pl_pwr_ch_4/GND, port TRM_BUS.TRM_GND  [also labelled GND_PL, TM_ANA_BOT_PL, TRM_GND]
VBAT: port VBAT, sheet pl_pwr_ch_1/VBAT, sheet pl_pwr_ch_2/VBAT, sheet pl_pwr_ch_3/VBAT, sheet pl_pwr_ch_4/VBAT
A_CPU_ERROR: sheet pl_interface_1/TMI_3, port PL_ISS_INPUT.A_CPU_ERROR
A_CPU_ERROR_PL: H1.20 ; sheet pl_interface_1/TMI_PL_3
A_INT: sheet pl_interface_1/TMI_0, port PL_ISS_INPUT.A_INT
A_INT_PL: H1.17 ; sheet pl_interface_1/TMI_PL_0
A_PWR_ERROR: sheet pl_interface_1/TMI_1, port PL_ISS_INPUT.A_PWR_ERROR
A_PWR_ERROR_PL: H1.19 ; sheet pl_interface_1/TMI_PL_1
A_RSTFPGA: sheet pl_interface_1/KU_0, port PL_ISS_OUTPUT.A_RSTFPGA
A_RSTFPGA_PL: H1.11 ; sheet pl_interface_1/KU_PL_0
A_RSTLEON: sheet pl_interface_1/KU_1, port PL_ISS_OUTPUT.A_RSTLEON
A_RSTLEON_PL: H1.12 ; sheet pl_interface_1/KU_PL_1
A_TM4_reserve: H1.21
A_TM5_reserve: H1.22
A_TM6_reserve: H1.23
A_TM7_reserve: H1.24
A_WATCHDOG: sheet pl_interface_1/TMI_2, port PL_ISS_INPUT.A_WATCHDOG
A_WATCHDOG_PL: H1.18 ; sheet pl_interface_1/TMI_PL_2
B_CPU_ERROR: sheet pl_interface_2/TMI_3, port PL_ISS_INPUT.B_CPU_ERROR
B_CPU_ERROR_PL: H2.20 ; sheet pl_interface_2/TMI_PL_3
B_INT: sheet pl_interface_2/TMI_0, port PL_ISS_INPUT.B_INT
B_INT_PL: H2.17 ; sheet pl_interface_2/TMI_PL_0
B_PWR_ERROR: sheet pl_interface_2/TMI_1, port PL_ISS_INPUT.B_PWR_ERROR
B_PWR_ERROR_PL: H2.19 ; sheet pl_interface_2/TMI_PL_1
B_RSTFPGA: sheet pl_interface_2/KU_0, port PL_ISS_OUTPUT.B_RSTFPGA
B_RSTFPGA_PL: H2.11 ; sheet pl_interface_2/KU_PL_0
B_RSTLEON: sheet pl_interface_2/KU_1, port PL_ISS_OUTPUT.B_RSTLEON
B_RSTLEON_PL: H2.12 ; sheet pl_interface_2/KU_PL_1
B_TM4_reserve: H2.21
B_TM5_reserve: H2.22
B_TM6_reserve: H2.23
B_TM7_reserve: H2.24
B_WATCHDOG: sheet pl_interface_2/TMI_2, port PL_ISS_INPUT.B_WATCHDOG
B_WATCHDOG_PL: H2.18 ; sheet pl_interface_2/TMI_PL_2
C_TK_nRESET: sheet pl_interface_3/KU_0, port PL_ISS_OUTPUT.C_TK_nRESET
C_TK_nRESET_PL: H2.31 ; sheet pl_interface_3/KU_PL_0
C_TK_SPI_SEL: sheet pl_interface_3/KU_1, port PL_ISS_OUTPUT.C_TK_SPI_SEL
C_TK_SPI_SEL_PL: H2.33 ; sheet pl_interface_3/KU_PL_1
C_TM_CPU_OK: sheet pl_interface_3/TMI_2, port PL_ISS_INPUT.C_TM_CPU_OK
C_TM_CPU_OK_PL: H2.37 ; sheet pl_interface_3/TMI_PL_2
C_TM_ERR: sheet pl_interface_3/TMI_3, port PL_ISS_INPUT.C_TM_ERR
C_TM_ERR_PL: H2.38 ; sheet pl_interface_3/TMI_PL_3
C_TM_INT: sheet pl_interface_3/TMI_1, port PL_ISS_INPUT.C_TM_INT
C_TM_INT_PL: H2.36 ; sheet pl_interface_3/TMI_PL_1
C_TM_PWR_ERR: sheet pl_interface_3/TMI_0, port PL_ISS_INPUT.C_TM_PWR_ERR
C_TM_PWR_ERR_PL: H2.35 ; sheet pl_interface_3/TMI_PL_0
CANH RX_1.1A: H1.6 ; sheet pl_interface_1/CANH_RX
CANH RX_1.1B: H2.6 ; sheet pl_interface_2/CANH_RX
CANH RX_PL1.2: H2.32 ; sheet pl_interface_3/CANH_RX
CANH RX_PL2: H1.48 ; sheet pl_interface_4/CANH_RX
CANH TX_1.1A: H1.2 ; sheet pl_interface_1/CANH_TX
CANH TX_1.1B: H2.2 ; sheet pl_interface_2/CANH_TX
CANH TX_PL1.2: H2.28 ; sheet pl_interface_3/CANH_TX
CANH TX_PL2: H1.44 ; sheet pl_interface_4/CANH_TX
CANL RX_1.1A: H1.8 ; sheet pl_interface_1/CANL_RX
CANL RX_1.1B: H2.8 ; sheet pl_interface_2/CANL_RX
CANL RX_PL1.2: H2.34 ; sheet pl_interface_3/CANL_RX
CANL RX_PL2: H1.50 ; sheet pl_interface_4/CANL_RX
CANL TX_1.1A: H1.4 ; sheet pl_interface_1/CANL_TX
CANL TX_1.1B: H2.4 ; sheet pl_interface_2/CANL_TX
CANL TX_PL1.2: H2.30 ; sheet pl_interface_3/CANL_TX
CANL TX_PL2: H1.46 ; sheet pl_interface_4/CANL_TX
CURRENT_MON: sheet pl_interface_4/TMI_1, port PL_ISS_INPUT.CURRENT_MON
CURRENT_MON_PL: H2.51 ; sheet pl_interface_4/TMI_PL_1
EXT_RESET: sheet pl_interface_4/KU_0, port PL_ISS_OUTPUT.EXT_RESET
EXT_RESET_PL: H2.45 ; sheet pl_interface_4/KU_PL_0
INTERRUPT: sheet pl_interface_4/TMI_2, port PL_ISS_INPUT.INTERRUPT
INTERRUPT_PL: H2.49 ; sheet pl_interface_4/TMI_PL_2
KU_1_PL2: sheet pl_interface_4/KU_1, port PL_ISS_OUTPUT.KU_1_PL2
KU_2_PL1.1A: sheet pl_interface_1/KU_2, port PL_ISS_OUTPUT.KU_2_PL1.1A
KU_2_PL1.1B: sheet pl_interface_2/KU_2, port PL_ISS_OUTPUT.KU_2_PL1.1B
KU_2_PL1.2: sheet pl_interface_3/KU_2, port PL_ISS_OUTPUT.KU_2_PL1.2
KU_2_PL2: sheet pl_interface_4/KU_2, port PL_ISS_OUTPUT.KU_2_PL2
KU_3_PL1.1A: sheet pl_interface_1/KU_3, port PL_ISS_OUTPUT.KU_3_PL1.1A
KU_3_PL1.1B: sheet pl_interface_2/KU_3, port PL_ISS_OUTPUT.KU_3_PL1.1B
KU_3_PL1.2: sheet pl_interface_3/KU_3, port PL_ISS_OUTPUT.KU_3_PL1.2
KU_3_PL2: sheet pl_interface_4/KU_3, port PL_ISS_OUTPUT.KU_3_PL2
PWR_ALERT: sheet pl_pwr_ch_1/PWR_ALERT, sheet pl_pwr_ch_2/PWR_ALERT, sheet pl_pwr_ch_3/PWR_ALERT, sheet pl_pwr_ch_4/PWR_ALERT, port PWR_BUS.PWR_ALERT
PWR_ENA_1_PL1.1A: sheet pl_pwr_ch_1/ENA_1, port PWR_IO.PWR_ENA_1_PL1.1A
PWR_ENA_1_PL1.1B: sheet pl_pwr_ch_2/ENA_1, port PWR_IO.PWR_ENA_1_PL1.1B
PWR_ENA_1_PL1.2: sheet pl_pwr_ch_3/ENA_1, port PWR_IO.PWR_ENA_1_PL1.2
PWR_ENA_1_PL2: sheet pl_pwr_ch_4/ENA_1, port PWR_IO.PWR_ENA_1_PL2
PWR_ENA_2_PL1.1A: sheet pl_pwr_ch_1/ENA_2, port PWR_IO.PWR_ENA_2_PL1.1A
PWR_ENA_2_PL1.1B: sheet pl_pwr_ch_2/ENA_2, port PWR_IO.PWR_ENA_2_PL1.1B
PWR_ENA_2_PL1.2: sheet pl_pwr_ch_3/ENA_2, port PWR_IO.PWR_ENA_2_PL1.2
PWR_ENA_2_PL2: sheet pl_pwr_ch_4/ENA_2, port PWR_IO.PWR_ENA_2_PL2
PWR_ENA_3_PL1.1A: sheet pl_pwr_ch_1/ENA_3, port PWR_IO.PWR_ENA_3_PL1.1A
PWR_ENA_3_PL1.1B: sheet pl_pwr_ch_2/ENA_3, port PWR_IO.PWR_ENA_3_PL1.1B
PWR_ENA_3_PL1.2: sheet pl_pwr_ch_3/ENA_3, port PWR_IO.PWR_ENA_3_PL1.2
PWR_ENA_3_PL2: sheet pl_pwr_ch_4/ENA_3, port PWR_IO.PWR_ENA_3_PL2
PWR_GD: sheet pl_pwr_ch_1/PWR_GD_5V, sheet pl_pwr_ch_2/PWR_GD_5V, sheet pl_pwr_ch_3/PWR_GD_5V, sheet pl_pwr_ch_4/PWR_GD_5V, port PWR_BUS.PWR_GD
PWR_SCL: sheet pl_pwr_ch_1/SCL, sheet pl_pwr_ch_2/SCL, sheet pl_pwr_ch_3/SCL, sheet pl_pwr_ch_3/I2C_A0, sheet pl_pwr_ch_4/SCL, port PWR_BUS.PWR_SCL
PWR_SDA: sheet pl_pwr_ch_1/SDA, sheet pl_pwr_ch_2/SDA, sheet pl_pwr_ch_2/I2C_A0, sheet pl_pwr_ch_3/SDA, sheet pl_pwr_ch_4/SDA, port PWR_BUS.PWR_SDA
SYS_FAILURE: sheet pl_interface_4/TMI_0, port PL_ISS_INPUT.SYS_FAILURE
SYS_FAILURE_PL: H2.47 ; sheet pl_interface_4/TMI_PL_0
TM_ANA: sheet pl_interface_4/TMI_3, port PL_ISS_INPUT.TM_ANA
TM_ANA_TOP_PL: H2.50 ; sheet pl_interface_4/ATMI_PL_0
TRM_ALERT: H1.52 ; port TRM_BUS.TRM_ALERT
TRM_SCL: H2.14 ; port TRM_BUS.TRM_SCL
TRM_SDA: H2.13 ; port TRM_BUS.TRM_SDA
UART_RX_PL1.1A: sheet pl_interface_1/UART_RX, port PL_ISS_UART.UART_RX_PL1.1A
UART_RX_PL1.1B: sheet pl_interface_2/UART_RX, port PL_ISS_UART.UART_RX_PL1.1B
UART_RX_PL1.2: sheet pl_interface_3/UART_RX, port PL_ISS_UART.UART_RX_PL1.2
UART_RX_PL2: sheet pl_interface_4/UART_RX, port PL_ISS_UART.UART_RX_PL2
UART_TX_PL1.1A: sheet pl_interface_1/UART_TX, port PL_ISS_UART.UART_TX_PL1.1A
UART_TX_PL1.1B: sheet pl_interface_2/UART_TX, port PL_ISS_UART.UART_TX_PL1.1B
UART_TX_PL1.2: sheet pl_interface_3/UART_TX, port PL_ISS_UART.UART_TX_PL1.2
UART_TX_PL2: sheet pl_interface_4/UART_TX, port PL_ISS_UART.UART_TX_PL2

Not connected (* = marked no-connect by the designer): H1 27 28 29 30 31 32 33 34 35 36 37 38 47 49 51; H2 43 48

### Notes on the sheet
- (near H1) Разъем сопряжения с ПН
- ver1.2: value for PULL_UP_I2C to 10k
- Addr 1
- Addr 3
- В версии 1.0 У ПН1.1А перепутаны RX и TX. У остальных корректно.
- H1, H2 у края платы справа.
  H2 ближе к краю платы.
  Первый пин снизу.
  Смотреть сверху платы.
- Addr 2
- Addr 4
- Канал для ПН2_TAS необходимо сконфигурировать для работы с аналоговым сигналом.
- Подп. и дата
- Инв. № дубл.
- Взам. инв. №
- Инв. № подл.
- Изм.
- Лист
- № докум.
- Подп.
- Дата
- Форма 2а ГОСТ 2.104-2006
- Копировал
- Формат А3

### Library data of the parts
H1 H2 = ESQ-126-39-G-D: Elevated socket, dual-row, 26-pin per row; Назначение: Сквозной разъем, двойно, 52 контакта, шаг 2,54 мм; Потребление, Вт: 0,00; Наименование: ESQ-126-39-G-D

## Sheet norbi_lm_pl_interface.SchDoc: Имя
size 209 x 297 mm; ApprovedBy: Утвердил; CheckedBy: Проверил; Author: Разработал; Organization: НГУ; DocumentNumber: Децимальный номер Э3; SheetNumber: Лист; SheetTotal: Листов; PageSetup: Record=PageOptions|CenterHorizontal=True|CenterVertical=True|PrintScale=1.00|XCorrection=1.00|YCorrection=1.00|PrintKind=1|BorderSize=5000000|LeftOffset=0|BottomOffset=0|Orientation=2|PaperLength=1000|PaperWidth=1000|Scale=100|PaperSource=15|PrintQuality=1200|MediaType=1|DitherType=10|PaperKind=A3|PrintScaleMode=1; Weight: -; ScaleFactor: -; NormInspection: Норм.Контр.
Used 4 times, as channels pl_iss/pl_interface_1, pl_iss/pl_interface_2, pl_iss/pl_interface_3, pl_iss/pl_interface_4. Parts and nets are listed once, with the designators drawn on the sheet.
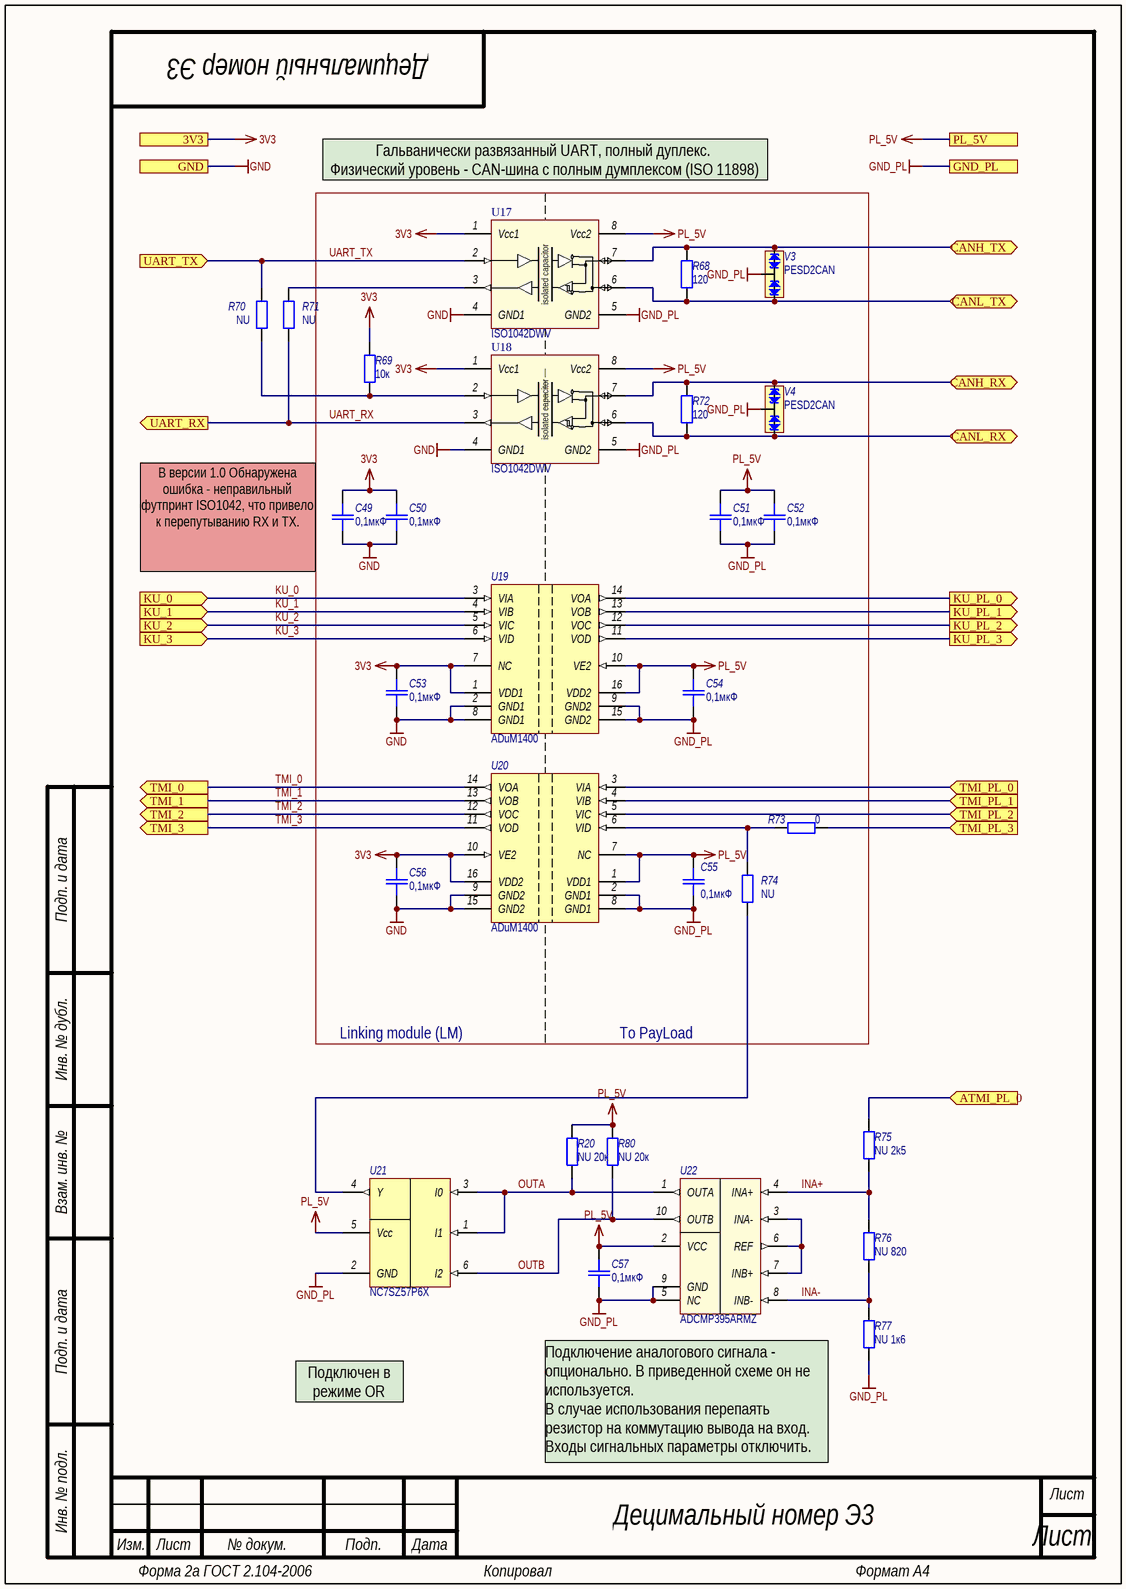
[diagram p2: norbi_lm_pl_interface.SchDoc]

### Parts
C49  0,1мкФ  [CR-0603]
C50  0,1мкФ  [CR-0603]
C51  0,1мкФ  [CR-0603]
C52  0,1мкФ  [CR-0603]
C53  0,1мкФ  [CR-0603]
C54  0,1мкФ  [CR-0603]
C55  0,1мкФ  [CR-0603]
C56  0,1мкФ  [CR-0603]
C57  0,1мкФ  [CR-0603]
R20  NU 20к  [CR-0603]
R68  120  [CR-0603]
R69  10к  [CR-0603]
R70  NU  [CR-0603]
R71  NU  [CR-0603]
R72  120  [CR-0603]
R73  0  [CR-0603]
R74  NU  [CR-0603]
R75  NU 2k5  [CR-0603]
R76  NU 820  [CR-0603]
R77  NU 1к6  [CR-0603]
R80  NU 20к  [CR-0603]
U17  Наименование: ISO1042DWV  [SOIC-8-WIDE]  (hidden comment: ISO1042)
U18  Наименование: ISO1042DWV  [SOIC-8-WIDE]  (hidden comment: ISO1042)
U19  ADuM1400  [SOIC-16-WIDE]
U20  ADuM1400  [SOIC-16-WIDE]
U21  NC7SZ57P6X  [SC70 6-Lead]
U22  ADCMP395ARMZ  [MSOP-10]
V3  PESD2CAN  [SOT-23]
V4  PESD2CAN  [SOT-23]

### Ports
3V3, ATMI_PL_0 (in), CANH_RX (bidir), CANH_TX (bidir), CANL_RX (bidir), CANL_TX (bidir), GND, GND_PL, KU_0 (in), KU_1 (in), KU_2 (in), KU_3 (in), KU_PL_0 (out), KU_PL_1 (out), KU_PL_2 (out), KU_PL_3 (out), PL_5V, TMI_0 (out), TMI_1 (out), TMI_2 (out), TMI_3 (out), TMI_PL_0 (in), TMI_PL_1 (in), TMI_PL_2 (in), TMI_PL_3 (in), UART_RX (out), UART_TX (in)

### Nets
3V3: C49.2 C50.2 C53.2 C56.2 R69.1 U17.1(Vcc1) U18.1(Vcc1) U19.1(VDD1) U19.7(NC) U20.10(VE2) U20.16(VDD2) ; port 3V3
GND: C49.1 C50.1 C53.1 C56.1 U17.4(GND1) U18.4(GND1) U19.2(GND1) U19.8(GND1) U20.9(GND2) U20.15(GND2) ; port GND
GND_PL: C51.1 C52.1 C54.1 C55.1 C57.1 R77.1 U17.5(GND2) U18.5(GND2) U19.9(GND2) U19.15(GND2) U20.2(GND1) U20.8(GND1) U21.2(GND) U22.5(NC) U22.9(GND) V3.3(CC) V4.3(CC) ; port GND_PL
PL_5V: C51.2 C52.2 C54.2 C55.2 C57.2 R20.2 R80.2 U17.8(Vcc2) U18.8(Vcc2) U19.10(VE2) U19.16(VDD2) U20.1(VDD1) U20.7(NC) U21.5(Vcc) U22.2(VCC) ; port PL_5V
ATMI_PL_0: R75.2 ; port ATMI_PL_0
CANH_RX: R72.2 U18.7(CANH) V4.1(C1) ; port CANH_RX
CANH_TX: R68.2 U17.7(CANH) V3.1(C1) ; port CANH_TX
CANL_RX: R72.1 U18.6(CANL) V4.2(C2) ; port CANL_RX
CANL_TX: R68.1 U17.6(CANL) V3.2(C2) ; port CANL_TX
INA+: R75.1 R76.2 U22.4(INA+)
INA-: R76.1 R77.2 U22.8(INB-)
KU_0: U19.3(VIA) ; port KU_0
KU_1: U19.4(VIB) ; port KU_1
KU_2: U19.5(VIC) ; port KU_2
KU_3: U19.6(VID) ; port KU_3
KU_PL_0: U19.14(VOA) ; port KU_PL_0
KU_PL_1: U19.13(VOB) ; port KU_PL_1
KU_PL_2: U19.12(VOC) ; port KU_PL_2
KU_PL_3: U19.11(VOD) ; port KU_PL_3
OUTA: R20.1 U21.1(I1) U21.3(I0) U22.1(OUTA)
OUTB: R80.1 U21.6(I2) U22.10(OUTB)
TMI_0: U20.14(VOA) ; port TMI_0
TMI_1: U20.13(VOB) ; port TMI_1
TMI_2: U20.12(VOC) ; port TMI_2
TMI_3: U20.11(VOD) ; port TMI_3
TMI_PL_0: U20.3(VIA) ; port TMI_PL_0
TMI_PL_1: U20.4(VIB) ; port TMI_PL_1
TMI_PL_2: U20.5(VIC) ; port TMI_PL_2
TMI_PL_3: R73.1 ; port TMI_PL_3
UART_RX: R71.1 U18.3(RXD) ; port UART_RX
UART_TX: R70.2 U17.2(TXD) ; port UART_TX
NetR69_2: R69.2 R70.1 U18.2(TXD)
NetR71_2: R71.2 U17.3(RXD)
NetR73_2: R73.2 R74.2 U20.6(VID)
NetR74_1: R74.1 U21.4(Y)
NetU22_3: U22.3(INA-) U22.6(REF) U22.7(INB+)

### Channels
pl_iss/pl_interface_1: designators end in _1; ports 3V3=3V3 ATMI_PL_0=ATMI_PL_0_PL1.1A CANH_RX=CANH RX_1.1A CANH_TX=CANH TX_1.1A CANL_RX=CANL RX_1.1A CANL_TX=CANL TX_1.1A GND=GND GND_PL=GND KU_0=A_RSTFPGA KU_1=A_RSTLEON KU_2=KU_2_PL1.1A KU_3=KU_3_PL1.1A KU_PL_0=A_RSTFPGA_PL KU_PL_1=A_RSTLEON_PL KU_PL_2=KU_2_PL_PL1.1A KU_PL_3=KU_3_PL_PL1.1A PL_5V=5V_PL1.1А TMI_0=A_INT TMI_1=A_PWR_ERROR TMI_2=A_WATCHDOG TMI_3=A_CPU_ERROR TMI_PL_0=A_INT_PL TMI_PL_1=A_PWR_ERROR_PL TMI_PL_2=A_WATCHDOG_PL TMI_PL_3=A_CPU_ERROR_PL UART_RX=UART_RX_PL1.1A UART_TX=UART_TX_PL1.1A
pl_iss/pl_interface_2: designators end in _2; ports 3V3=3V3 ATMI_PL_0=ATMI_PL_0_PL1.1B CANH_RX=CANH RX_1.1B CANH_TX=CANH TX_1.1B CANL_RX=CANL RX_1.1B CANL_TX=CANL TX_1.1B GND=GND GND_PL=GND KU_0=B_RSTFPGA KU_1=B_RSTLEON KU_2=KU_2_PL1.1B KU_3=KU_3_PL1.1B KU_PL_0=B_RSTFPGA_PL KU_PL_1=B_RSTLEON_PL KU_PL_2=KU_2_PL_PL1.1B KU_PL_3=KU_3_PL_PL1.1B PL_5V=5V_PL1.1B TMI_0=B_INT TMI_1=B_PWR_ERROR TMI_2=B_WATCHDOG TMI_3=B_CPU_ERROR TMI_PL_0=B_INT_PL TMI_PL_1=B_PWR_ERROR_PL TMI_PL_2=B_WATCHDOG_PL TMI_PL_3=B_CPU_ERROR_PL UART_RX=UART_RX_PL1.1B UART_TX=UART_TX_PL1.1B
pl_iss/pl_interface_3: designators end in _3; ports 3V3=3V3 ATMI_PL_0=ATMI_PL_0_PL1.2 CANH_RX=CANH RX_PL1.2 CANH_TX=CANH TX_PL1.2 CANL_RX=CANL RX_PL1.2 CANL_TX=CANL TX_PL1.2 GND=GND GND_PL=GND KU_0=C_TK_nRESET KU_1=C_TK_SPI_SEL KU_2=KU_2_PL1.2 KU_3=KU_3_PL1.2 KU_PL_0=C_TK_nRESET_PL KU_PL_1=C_TK_SPI_SEL_PL KU_PL_2=KU_PL_2_PL1.2 KU_PL_3=KU_PL_3_PL1.2 PL_5V=5V_PL1.2 TMI_0=C_TM_PWR_ERR TMI_1=C_TM_INT TMI_2=C_TM_CPU_OK TMI_3=C_TM_ERR TMI_PL_0=C_TM_PWR_ERR_PL TMI_PL_1=C_TM_INT_PL TMI_PL_2=C_TM_CPU_OK_PL TMI_PL_3=C_TM_ERR_PL UART_RX=UART_RX_PL1.2 UART_TX=UART_TX_PL1.2
pl_iss/pl_interface_4: designators end in _4; ports 3V3=3V3 ATMI_PL_0=TM_ANA_TOP_PL CANH_RX=CANH RX_PL2 CANH_TX=CANH TX_PL2 CANL_RX=CANL RX_PL2 CANL_TX=CANL TX_PL2 GND=GND GND_PL=GND KU_0=EXT_RESET KU_1=KU_1_PL2 KU_2=KU_2_PL2 KU_3=KU_3_PL2 KU_PL_0=EXT_RESET_PL KU_PL_1=KU_1_PL_PL2 KU_PL_2=KU_2_PL_PL2 KU_PL_3=KU_3_PL_PL2 PL_5V=5V_PL2 TMI_0=SYS_FAILURE TMI_1=CURRENT_MON TMI_2=INTERRUPT TMI_3=TM_ANA TMI_PL_0=SYS_FAILURE_PL TMI_PL_1=CURRENT_MON_PL TMI_PL_2=INTERRUPT_PL TMI_PL_3=NetR73_4_1 UART_RX=UART_RX_PL2 UART_TX=UART_TX_PL2

### Notes on the sheet
- Гальванически развязанный UART, полный дуплекс.
  Физический уровень - CAN-шина с полным думплексом (ISO 11898)
- (near C49) В версии 1.0 Обнаружена ошибка - неправильный футпринт ISO1042, что привело к перепутыванию RX и TX.
- Linking module (LM)
- To PayLoad
- Подключен в режиме OR
- Подключение аналогового сигнала - опционально. В приведенной схеме он не используется.
  В случае использования перепаять резистор на коммутацию вывода на вход. Входы сигнальных параметры отключить.
- Подп. и дата
- Инв. № дубл.
- Взам. инв. №
- Инв. № подл.
- Изм.
- Лист
- № докум.
- Подп.
- Дата
- Форма 2а ГОСТ 2.104-2006
- Копировал
- Формат А4
- (in symbol ISO1042) isolated capacitor

### Library data of the parts
C49-C57 = C_smd: as C1 on sheet norbi_lm_main; Наименование: SMD-0603; Value: 0,1мкФ
R20 R69-R71 R73 R74 R80 = R_smd: Резистор для поверхностного монтажа; Наименование: SMD-0603 20%; Назначение: Чип-резистор; Потребление, Вт: 0,001
  R20 R80: Value: NU 20к
  R69: Value: 10к
  R70 R71 R74: Value: NU
  R73: Value: 0
R68 R72 R75-R77 = R_smd: Резистор для поверхностного монтажа; Наименование: SMD-0603 1%; Назначение: Чип-резистор; Потребление, Вт: 0,001
  R68 R72: Value: 120
  R75: Value: NU 2k5; Parameter 1: *
  R76: Value: NU 820; Parameter 1: *
  R77: Value: NU 1к6; Parameter 1: *
U17 U18 = ISO1042: Isolated CAN Transceiver; Назначение: Изолированный CAN приемник; Потребление, Вт: 0,001
U19 U20 = ADuM1400: Quad Channel Digital Isolator, 2.5 KV rms Insulation Rating; Назначение: 4-канальный цифровой изолятор; Потребление, Вт: 0,025; Наименование: ADuM1400
U21 = NC7SZ57: Universal Configurable 2-Input / Logic Gates; Потребление, Вт: 0,001; Value: NU; Назначение: Universal Configurable 2-Input; Наименование: NC7SZ57P6X
U22 = ADCMP395: Dual Comparators with Accurate Reference Output; Потребление, Вт: 0,001; Value: NU; Назначение: Dual Comparators with Accurate Reference Output; Наименование: ADCMP395ARMZ; ComponentLink1Description: Datasheet; ComponentLink1URL: https://www.analog.com/en/products/adcmp395.html
V3 V4 = PESD2CAN: CAN bus ESD protection diode; Назначение: Защитная диодная сборка CAN-шины от ЭСР; Потребление, Вт: 0,001; Наименование: PESD2CAN

## Sheet norbi_lm_single_power_ch.SchDoc: Имя
size 209 x 297 mm; ApprovedBy: Утвердил; CheckedBy: Проверил; Author: Разработал; Organization: НГУ; DocumentNumber: Децимальный номер Э3; SheetNumber: Лист; SheetTotal: Листов; PageSetup: Record=PageOptions|CenterHorizontal=True|CenterVertical=True|PrintScale=1.00|XCorrection=1.00|YCorrection=1.00|PrintKind=1|BorderSize=5000000|LeftOffset=0|BottomOffset=0|Orientation=2|PaperLength=1000|PaperWidth=1000|Scale=100|PaperSource=15|PrintQuality=1200|MediaType=1|DitherType=10|PaperKind=A3|PrintScaleMode=1; Weight: -; ScaleFactor: -; NormInspection: Норм.Контр.
Used 5 times, as channels pl_iss/pl_pwr_ch_1, pl_iss/pl_pwr_ch_2, pl_iss/pl_pwr_ch_3, pl_iss/pl_pwr_ch_4, lm_pwr_ch. Parts and nets are listed once, with the designators drawn on the sheet.
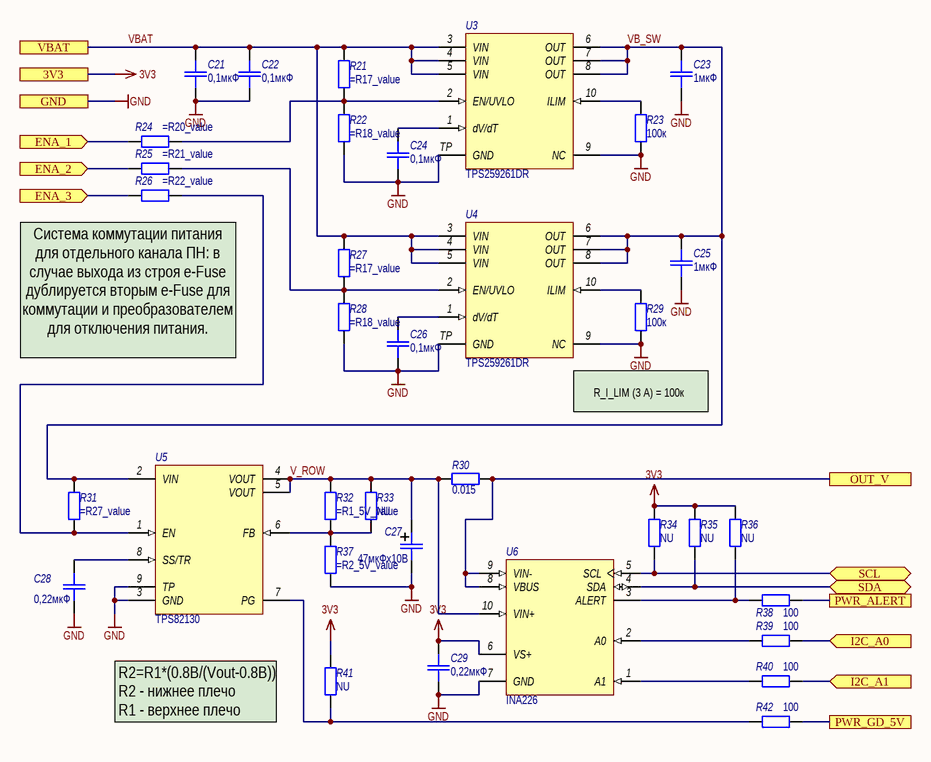
[diagram p3: norbi_lm_single_power_ch.SchDoc]

### Parts
C21  0,1мкФ  [CR-0603]
C22  0,1мкФ  [CR-0603]
C23  1мкФ  [CR-0603]
C24  0,1мкФ  [CR-0603]
C25  1мкФ  [CR-0603]
C26  0,1мкФ  [CR-0603]
C27  47мкФх10В  [C_SMD_SIZE_B]
C28  0,22мкФ  [CR-0603]
C29  0,22мкФ  [CR-0603]
R21  R17_value  [CR-0603]  (value not drawn)
R22  R18_value  [CR-0603]  (value not drawn)
R23  100к  [CR-0603]
R24  (no value)  [CR-0603]
R25  (no value)  [CR-0603]
R26  (no value)  [CR-0603]
R27  R17_value  [CR-0603]  (value not drawn)
R28  R18_value  [CR-0603]  (value not drawn)
R29  100к  [CR-0603]
R30  value 0.015  [CR-1206]  (hidden comment: 0,01)
R31  (no value)  [CR-0603]
R32  (no value)  [CR-0603]
R33  NU  [CR-0603]
R34  NU  [CR-0603]
R35  NU  [CR-0603]
R36  NU  [CR-0603]
R37  (no value)  [CR-0603]
R38  100  [CR-0603]
R39  100  [CR-0603]
R40  100  [CR-0603]
R41  NU  [CR-0603]
R42  100  [CR-0603]
U3  Наименование: TPS259261DR  [VSON-10]  (hidden comment: TPS259261ВК)
U4  Наименование: TPS259261DR  [VSON-10]  (hidden comment: TPS259261ВК)
U5  TPS82130  [uSiL-8]
U6  INA226  [VSSOP-8]

### Ports
3V3, ENA_1 (in), ENA_2 (in), ENA_3 (in), GND, I2C_A0 (in), I2C_A1 (in), OUT_V, PWR_ALERT, PWR_GD_5V, SCL (bidir), SDA (bidir), VBAT

### Nets
3V3: C29.2 R34.2 R35.2 R36.2 R41.2 U6.6(VS+) ; port 3V3
GND: C21.1 C22.1 C23.1 C24.1 C25.1 C26.1 C27.2 C28.1 C29.1 R22.2 R23.1 R28.2 R29.1 R37.1 U3.9(NC) U3.TP(GND) U4.9(NC) U4.TP(GND) U5.3(GND) U5.9(TP) U6.7(GND) ; port GND
ENA_1: R24.2 ; port ENA_1
ENA_2: R25.2 ; port ENA_2
ENA_3: R26.2 ; port ENA_3
I2C_A0: R39.1 ; port I2C_A0
I2C_A1: R40.1 ; port I2C_A1
OUT_V: R30.1 U6.8(VBUS) U6.9(VIN-) ; port OUT_V
PWR_ALERT: R38.1 ; port PWR_ALERT
PWR_GD_5V: R42.1 ; port PWR_GD_5V
SCL: R34.1 U6.5(SCL) ; port SCL
SDA: R35.1 U6.4(SDA) ; port SDA
V_ROW: C27.1 R30.2 R32.2 R33.2 U5.4(VOUT) U5.5(VOUT) U6.10(VIN+)
VB_SW: C23.2 C25.2 R31.2 U3.6(OUT) U3.7(OUT) U3.8(OUT) U4.6(OUT) U4.7(OUT) U4.8(OUT) U5.2(VIN)
VBAT: C21.2 C22.2 R21.1 R27.1 U3.3(VIN) U3.4(VIN) U3.5(VIN) U4.3(VIN) U4.4(VIN) U4.5(VIN) ; port VBAT
NetC24_2: C24.2 U3.1(dV/dT)
NetC26_2: C26.2 U4.1(dV/dT)
NetC28_2: C28.2 U5.8(SS/TR)
NetR21_2: R21.2 R22.1 R24.1 U3.2(EN/UVLO)
NetR23_2: R23.2 U3.10(ILIM)
NetR25_1: R25.1 R27.2 R28.1 U4.2(EN/UVLO)
NetR26_1: R26.1 R31.1 U5.1(EN)
NetR29_2: R29.2 U4.10(ILIM)
NetR32_1: R32.1 R33.1 R37.2 U5.6(FB)
NetR36_1: R36.1 R38.2 U6.3(ALERT)
NetR39_2: R39.2 U6.2(A0)
NetR40_2: R40.2 U6.1(A1)
NetR41_1: R41.1 R42.2 U5.7(PG)

### Channels
pl_iss/pl_pwr_ch_1: designators end in _1; ports 3V3=3V3 ENA_1=PWR_ENA_1_PL1.1A ENA_2=PWR_ENA_2_PL1.1A ENA_3=PWR_ENA_3_PL1.1A GND=GND I2C_A0=3V3 I2C_A1=GND OUT_V=5V_PL1.1А PWR_ALERT=PWR_ALERT PWR_GD_5V=PWR_GD SCL=PWR_SCL SDA=PWR_SDA VBAT=VBAT
pl_iss/pl_pwr_ch_2: designators end in _2; ports 3V3=3V3 ENA_1=PWR_ENA_1_PL1.1B ENA_2=PWR_ENA_2_PL1.1B ENA_3=PWR_ENA_3_PL1.1B GND=GND I2C_A0=PWR_SDA I2C_A1=GND OUT_V=5V_PL1.1B PWR_ALERT=PWR_ALERT PWR_GD_5V=PWR_GD SCL=PWR_SCL SDA=PWR_SDA VBAT=VBAT
pl_iss/pl_pwr_ch_3: designators end in _3; ports 3V3=3V3 ENA_1=PWR_ENA_1_PL1.2 ENA_2=PWR_ENA_2_PL1.2 ENA_3=PWR_ENA_3_PL1.2 GND=GND I2C_A0=PWR_SCL I2C_A1=GND OUT_V=5V_PL1.2 PWR_ALERT=PWR_ALERT PWR_GD_5V=PWR_GD SCL=PWR_SCL SDA=PWR_SDA VBAT=VBAT
pl_iss/pl_pwr_ch_4: designators end in _4; ports 3V3=3V3 ENA_1=PWR_ENA_1_PL2 ENA_2=PWR_ENA_2_PL2 ENA_3=PWR_ENA_3_PL2 GND=GND I2C_A0=GND I2C_A1=3V3 OUT_V=5V_PL2 PWR_ALERT=PWR_ALERT PWR_GD_5V=PWR_GD SCL=PWR_SCL SDA=PWR_SDA VBAT=VBAT
lm_pwr_ch: designators end in _5; ports 3V3=3V3 ENA_1=GND ENA_2=GND ENA_3=PWR_ENA_3V3 GND=GND I2C_A0=GND I2C_A1=GND OUT_V=3V3 PWR_ALERT=PWR_ALERT PWR_GD_5V=PWR_GD SCL=PWR_SCL SDA=PWR_SDA VBAT=VBAT

### Notes on the sheet
- (near R26) Система коммутации питания для отдельного канала ПН: в случае выхода из строя e-Fuse дублируется вторым e-Fuse для коммутации и преобразователем для отключения питания.
- R_I_LIM (3 А) = 100к
- R2=R1*(0.8В/(Vout-0.8B))
  R2 - нижнее плечо
  R1 - верхнее плечо
- Подп. и дата
- Инв. № дубл.
- Взам. инв. №
- Инв. № подл.
- Изм.
- Лист
- № докум.
- Подп.
- Дата
- Форма 2а ГОСТ 2.104-2006
- Копировал
- Формат А4

### Library data of the parts
C21-C26 C28 C29 = C_smd: as C1 on sheet norbi_lm_main; Наименование: SMD-0603
  C21 C22 C24 C26: Value: 0,1мкФ
  C23 C25: Value: 1мкФ
  C28 C29: Value: 0,22мкФ
C27 = C_pol_smd: Поляризованный конеднсатор для поверхностного монтажа; Назначение: Поляризованный чип-конденсатор; Наименование: Конденсатор танталовый SMD; Потребление, Вт: 0; Value: 47мкФх10В
R21-R29 R38-R40 R42 = R_smd: as R20 on sheet norbi_lm_pl_interface
  R21 R27: Value: =R17_value
  R22 R28: Value: =R18_value
  R23 R29: Value: 100к
  R24: Value: =R20_value
  R25: Value: =R21_value
  R26: Value: =R22_value
  R38-R40 R42: Value: 100
R30 = R_smd: Резистор для поверхностного монтажа; Назначение: Чип-резистор токоизмерительный; Наименование: PE1206DRM470R015L; Потребление, Вт: 0,001
R31 R34-R36 R41 = R_smd: Резистор для поверхностного монтажа; Назначение: Чип-резистор; Наименование: SMD-0603 20%; Потребление, Вт: 0,001
  R31: Value: =R27_value
  R34-R36 R41: Value: NU
R32 R33 R37 = R_smd: Резистор для поверхностного монтажа; Назначение: Чип-резистор; Наименование: SMD-0603 1%; Потребление, Вт: 0,001
  R32: Value: =R1_5V_value
  R33: Value: NU
  R37: Value: =R2_5V_value
U3 U4 = TPS259261: Simple 5-V/12-V eFuse Protection Switches; Потребление, Вт: 0,001; Назначение: Simple 5-V/12-V eFuse Protection Switches; ComponentLink1Description: Datasheet; ComponentLink1URL: http://www.ti.com/lit/ds/symlink/tps25925.pdf
U5 = TPS82130: 17-V Input 3-A Step-Down Converter MicroSiP™ Module with Integrated Inductor; Потребление, Вт: 1,0; ComponentLink1Description: Data sheet; ComponentLink1URL: http://www.ti.com/lit/ds/symlink/tps82130.pdf; Назначение: 17-V Input 3-A Step-Down Converter MicroSiP™ Module with Integrated Inductor; Наименование: TPS82130
U6 = INA226: High- or Low-Side Measurement, Bidirectional Current and Power Monitor With I2C Interface; Назначение: High-Side or Low-Side Measurement,; Потребление, Вт: 0,001; ComponentLink1Description: Data sheet; ComponentLink1URL: http://www.ti.com/lit/ds/symlink/ina226.pdf; Наименование: INA226

## Sheet norbi_lm_pl_dcr.SchDoc: Имя
size 209 x 297 mm; ApprovedBy: Утвердил; CheckedBy: Проверил; Author: Разработал; Organization: НГУ; DocumentNumber: Децимальный номер Э3; SheetNumber: Лист; SheetTotal: Листов; PageSetup: Record=PageOptions|CenterHorizontal=True|CenterVertical=True|PrintScale=1.00|XCorrection=1.00|YCorrection=1.00|PrintKind=1|BorderSize=5000000|LeftOffset=0|BottomOffset=0|Orientation=2|PaperLength=1000|PaperWidth=1000|Scale=100|PaperSource=15|PrintQuality=1200|MediaType=1|DitherType=10|PaperKind=A3|PrintScaleMode=1; Weight: -; ScaleFactor: -; NormInspection: Норм.Контр.
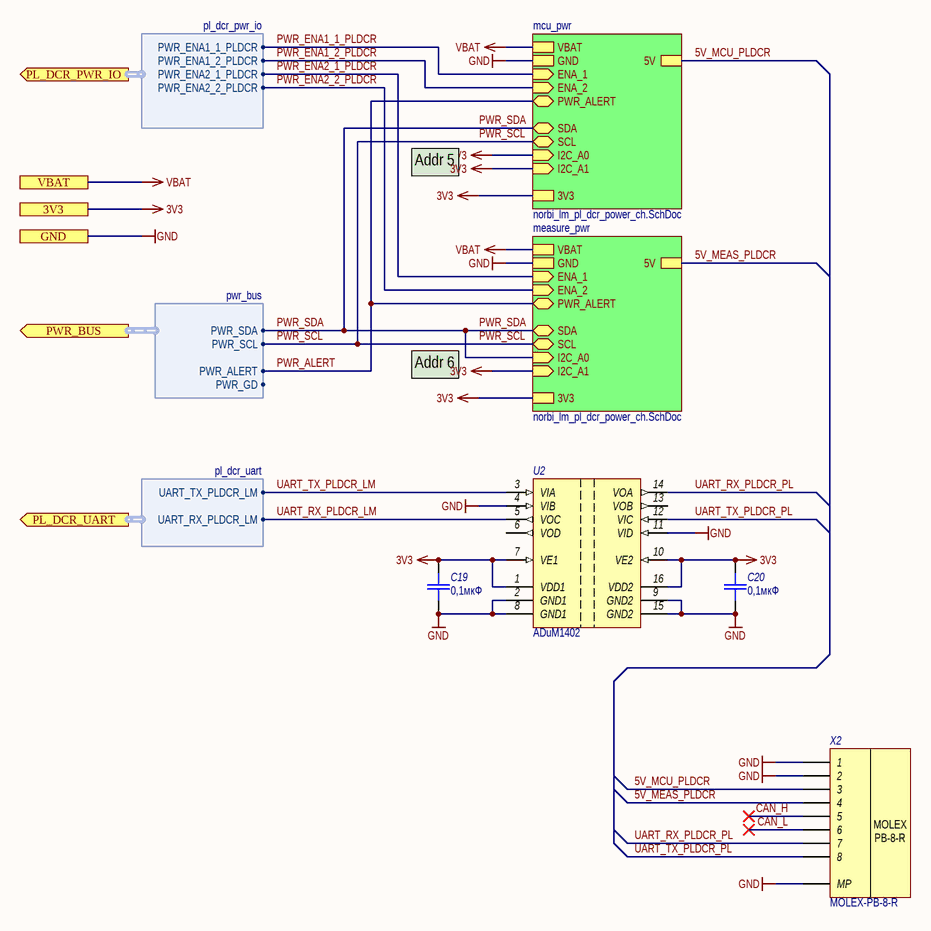
[diagram p4: norbi_lm_pl_dcr.SchDoc]

### Parts
C19  0,1мкФ  [CR-0805]
C20  0,1мкФ  [CR-0805]
U2  ADuM1402  [SOIC-16-WIDE]
X2  MOLEX-PB-8  [MOLEX-PB-8-R]  (value not drawn)

### Sub-sheets
mcu_pwr = norbi_lm_pl_dcr_power_ch.SchDoc: I2C_A1 (in), SCL (bidir), 5V, PWR_ALERT (bidir), SDA (bidir), I2C_A0 (in), VBAT, GND, 3V3, ENA_1 (in), ENA_2 (in)
measure_pwr = norbi_lm_pl_dcr_power_ch.SchDoc: I2C_A1 (in), SCL (bidir), 5V, PWR_ALERT (bidir), SDA (bidir), I2C_A0 (in), VBAT, GND, 3V3, ENA_1 (in), ENA_2 (in)

### Ports
3V3, GND, PL_DCR_PWR_IO (out, harness pl_dcr_pwr_io), PL_DCR_UART (out, harness pl_dcr_uart), PWR_BUS (out, harness pwr_bus), VBAT

### Harnesses
pl_dcr_uart: UART_TX_PLDCR_LM, UART_RX_PLDCR_LM
pwr_bus: PWR_SDA, PWR_SCL, PWR_ALERT, PWR_GD
pl_dcr_pwr_io: PWR_ENA1_1_PLDCR, PWR_ENA1_2_PLDCR, PWR_ENA2_1_PLDCR, PWR_ENA2_2_PLDCR

### Nets
3V3: C19.2 C20.2 U2.1(VDD1) U2.7(VE1) U2.10(VE2) U2.16(VDD2) ; port 3V3, sheet mcu_pwr/I2C_A1, sheet mcu_pwr/I2C_A0, sheet mcu_pwr/3V3, sheet measure_pwr/I2C_A1, sheet measure_pwr/3V3
GND: C19.1 C20.1 U2.2(GND1) U2.4(VIB) U2.8(GND1) U2.9(GND2) U2.11(VID) U2.15(GND2) X2.1 X2.2 X2.MP ; port GND, sheet mcu_pwr/GND, sheet measure_pwr/GND
VBAT: port VBAT, sheet mcu_pwr/VBAT, sheet measure_pwr/VBAT
5V_MCU_PLDCR: X2.3 ; sheet mcu_pwr/5V
5V_MEAS_PLDCR: X2.4 ; sheet measure_pwr/5V
CAN_H: X2.5
CAN_L: X2.6
PWR_ALERT: sheet mcu_pwr/PWR_ALERT, sheet measure_pwr/PWR_ALERT, port PWR_BUS.PWR_ALERT
PWR_ENA1_1_PLDCR: sheet mcu_pwr/ENA_1, port PL_DCR_PWR_IO.PWR_ENA1_1_PLDCR
PWR_ENA1_2_PLDCR: sheet mcu_pwr/ENA_2, port PL_DCR_PWR_IO.PWR_ENA1_2_PLDCR
PWR_ENA2_1_PLDCR: sheet measure_pwr/ENA_1, port PL_DCR_PWR_IO.PWR_ENA2_1_PLDCR
PWR_ENA2_2_PLDCR: sheet measure_pwr/ENA_2, port PL_DCR_PWR_IO.PWR_ENA2_2_PLDCR
PWR_SCL: sheet mcu_pwr/SCL, sheet measure_pwr/SCL, port PWR_BUS.PWR_SCL
PWR_SDA: sheet mcu_pwr/SDA, sheet measure_pwr/SDA, sheet measure_pwr/I2C_A0, port PWR_BUS.PWR_SDA
UART_RX_PLDCR_LM: U2.5(VOC) ; port PL_DCR_UART.UART_RX_PLDCR_LM
UART_RX_PLDCR_PL: U2.14(VOA) X2.7
UART_TX_PLDCR_LM: U2.3(VIA) ; port PL_DCR_UART.UART_TX_PLDCR_LM
UART_TX_PLDCR_PL: U2.12(VIC) X2.8

Not connected (* = marked no-connect by the designer): U2 6(VOD) 13(VOB)

### Notes on the sheet
- Addr 5
- Addr 6
- Подп. и дата
- Инв. № дубл.
- Взам. инв. №
- Инв. № подл.
- Изм.
- Лист
- № докум.
- Подп.
- Дата
- Форма 2а ГОСТ 2.104-2006
- Копировал
- Формат А4
- (in symbol MOLEX-PB-8) MOLEX / PB-8-R

### Library data of the parts
C19 C20 = C_smd: as C1 on sheet norbi_lm_main; Наименование: SMD-0603; Value: 0,1мкФ
U2 = ADuM1402: Quad Channel Digital Isolator, 2.5 KV rms Insulation Rating; Назначение: 4-канальный цифровой изолятор; Потребление, Вт: 0,025; Наименование: ADuM1402
X2 = MOLEX-PB-8: MOLEX PicoBlade 8-pin; Назначение: MOLEX PicoBlade 8-pin to board; Потребление, Вт: 0,001; Наименование: MOLEX-PB-8-R